# Altium project Dashcam_V2.0B.PrjPcb (part 1 of 9)
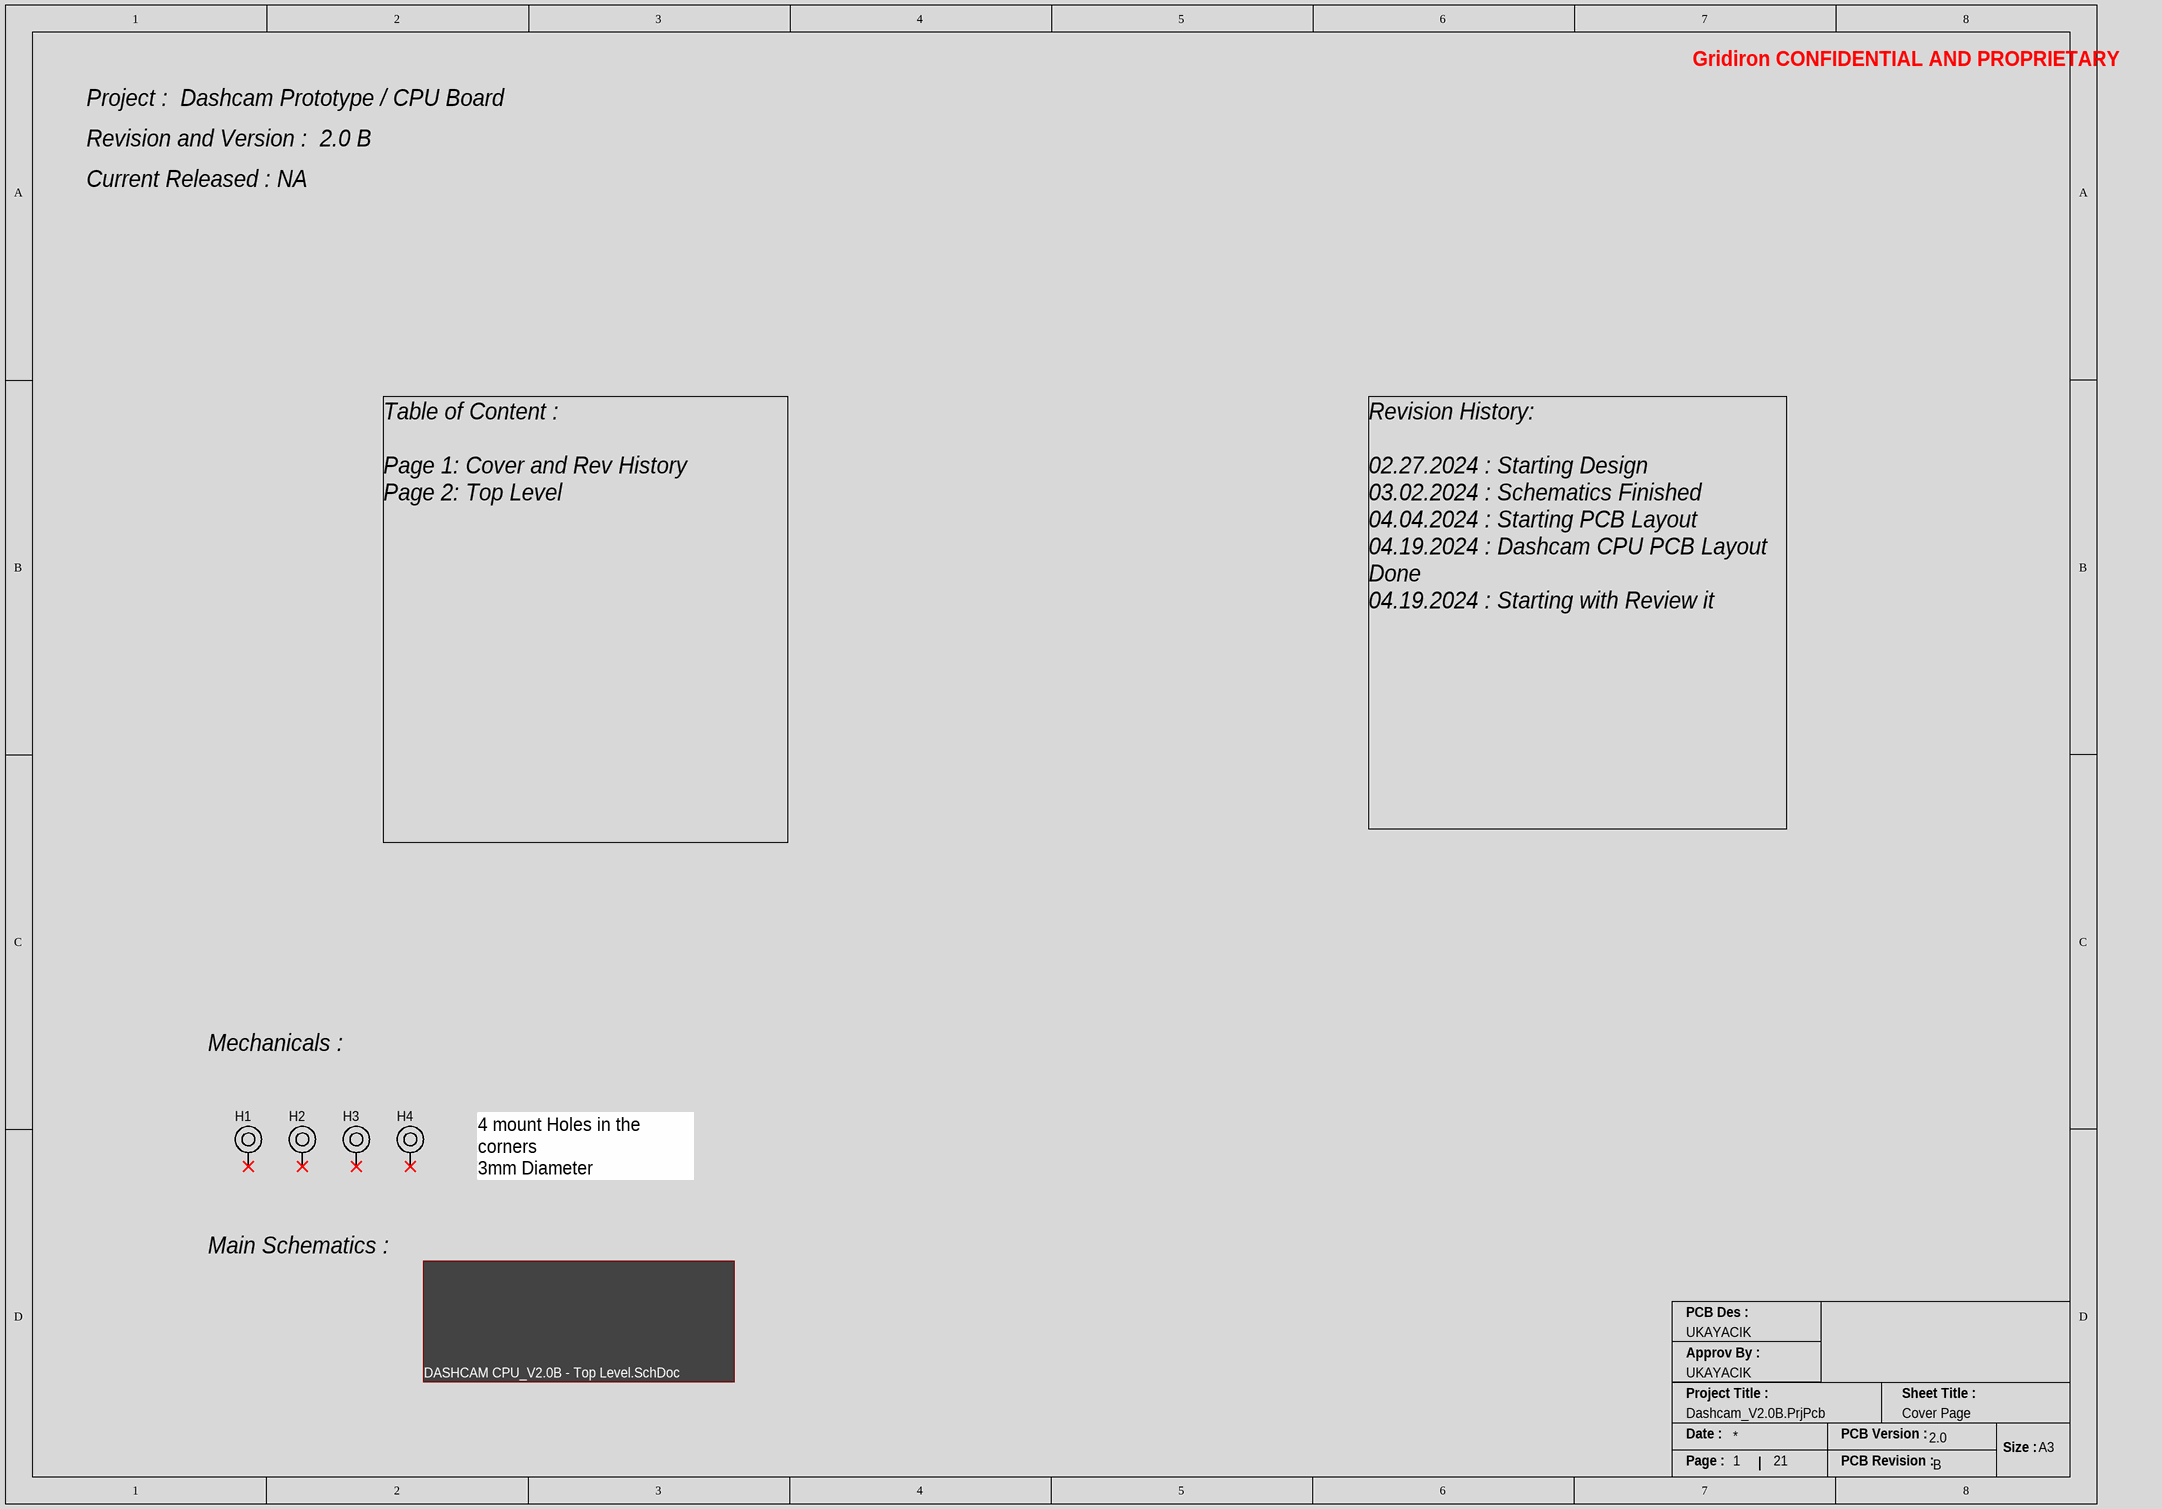
[diagram p0: DASHCAM_V2.0B - Cover and Revisions.SchDoc]
Version: 2.0; ProjectTitle: Dashcam CPU_V2.0B; Letter: B
20 sheets, 411 parts. Net scope: hierarchical (ports join the sheet entries above them; power ports are global).
Board file: Dashcam_V2.0B.PcbDoc
Sheets:
  DASHCAM_V2.0B - Cover and Revisions.SchDoc
  iMX 8M PLUS.SchDoc
    H = CPU IO.SchDoc
    I = CPU LPDDR4.SchDoc
    K = CPU PHY.SchDoc
    J = CPU MISC.SchDoc
    L = CPU Power.SchDoc
  PMIC.SchDoc
    O = Power TREE.SchDoc
    P = Converter.SchDoc
  LPDDR4.SchDoc
  eMMC FLASH.SchDoc
  PERIPHERALS.SchDoc
    Designator = TYPEC_PWR.SchDoc
    Designator = TYPEC_DATA.SchDoc
    U_uSD CARD = uSD CARD.SchDoc
    U_WIFI_BLE = WIFI_BLE.SchDoc
    U_GNSS_GPS_IMU = GNSS_GPS_IMU.SchDoc
    U_DBG BOOT_CONF = DBG BOOT_CONF.SchDoc
    U_CAMERA = CAMERA.SchDoc

## Sheet DASHCAM_V2.0B - Cover and Revisions.SchDoc
size A3; Email: eliofagundez07@gmail.com; DrawnBy: UKAYACIK; Engineer: UKAYACIK; DocumentNumber: 1; Revision: B; SheetNumber: 1; SheetTotal: 21; Sheet Title: Cover Page

### Parts
H1  Mounting Hole  [PTH_3.2X5]  (value not drawn)  (no BOM)
H2  Mounting Hole  [PTH_3.2X5]  (value not drawn)  (no BOM)
H3  Mounting Hole  [PTH_3.2X5]  (value not drawn)  (no BOM)
H4  Mounting Hole  [PTH_3.2X5]  (value not drawn)  (no BOM)

### Sub-sheets
U_DASHCAM CPU_V2.0B - Top Level = DASHCAM CPU_V2.0B - Top Level.SchDoc (file not in this document): no entries

### Nets

Not connected (* = marked no-connect by the designer): H1 1*; H2 1*; H3 1*; H4 1*

### Notes on the sheet
- Project :  Dashcam Prototype / CPU Board
- Gridiron CONFIDENTIAL AND PROPRIETARY
- Revision and Version :  2.0 B
- Current Released : NA
- Table of Content :
  Page 1: Cover and Rev History
  Page 2: Top Level
- Revision History:
  02.27.2024 : Starting Design
  03.02.2024 : Schematics Finished
  04.04.2024 : Starting PCB Layout
  04.19.2024 : Dashcam CPU PCB Layout Done
  04.19.2024 : Starting with Review it
- Mechanicals :
- 4 mount Holes in the corners
  3mm Diameter
- Main Schematics :
- PCB Des :
- Approv By :
- Project Title :
- Sheet Title :
- Date :
- PCB Version :
- Size :
- A3
- Page :
- PCB Revision :

### Library data of the parts
H1-H4 = MECHANICALS_MOUNT_PTH: Mounting Hole, Plated

## Sheet iMX 8M PLUS.SchDoc: i.MX 8M - BLOCK DIAGRAM
size A3; DrawnBy: UKAYACIK; Engineer: UKAYACIK; DocumentNumber: 8; Revision: A; SheetNumber: 3; SheetTotal: 21
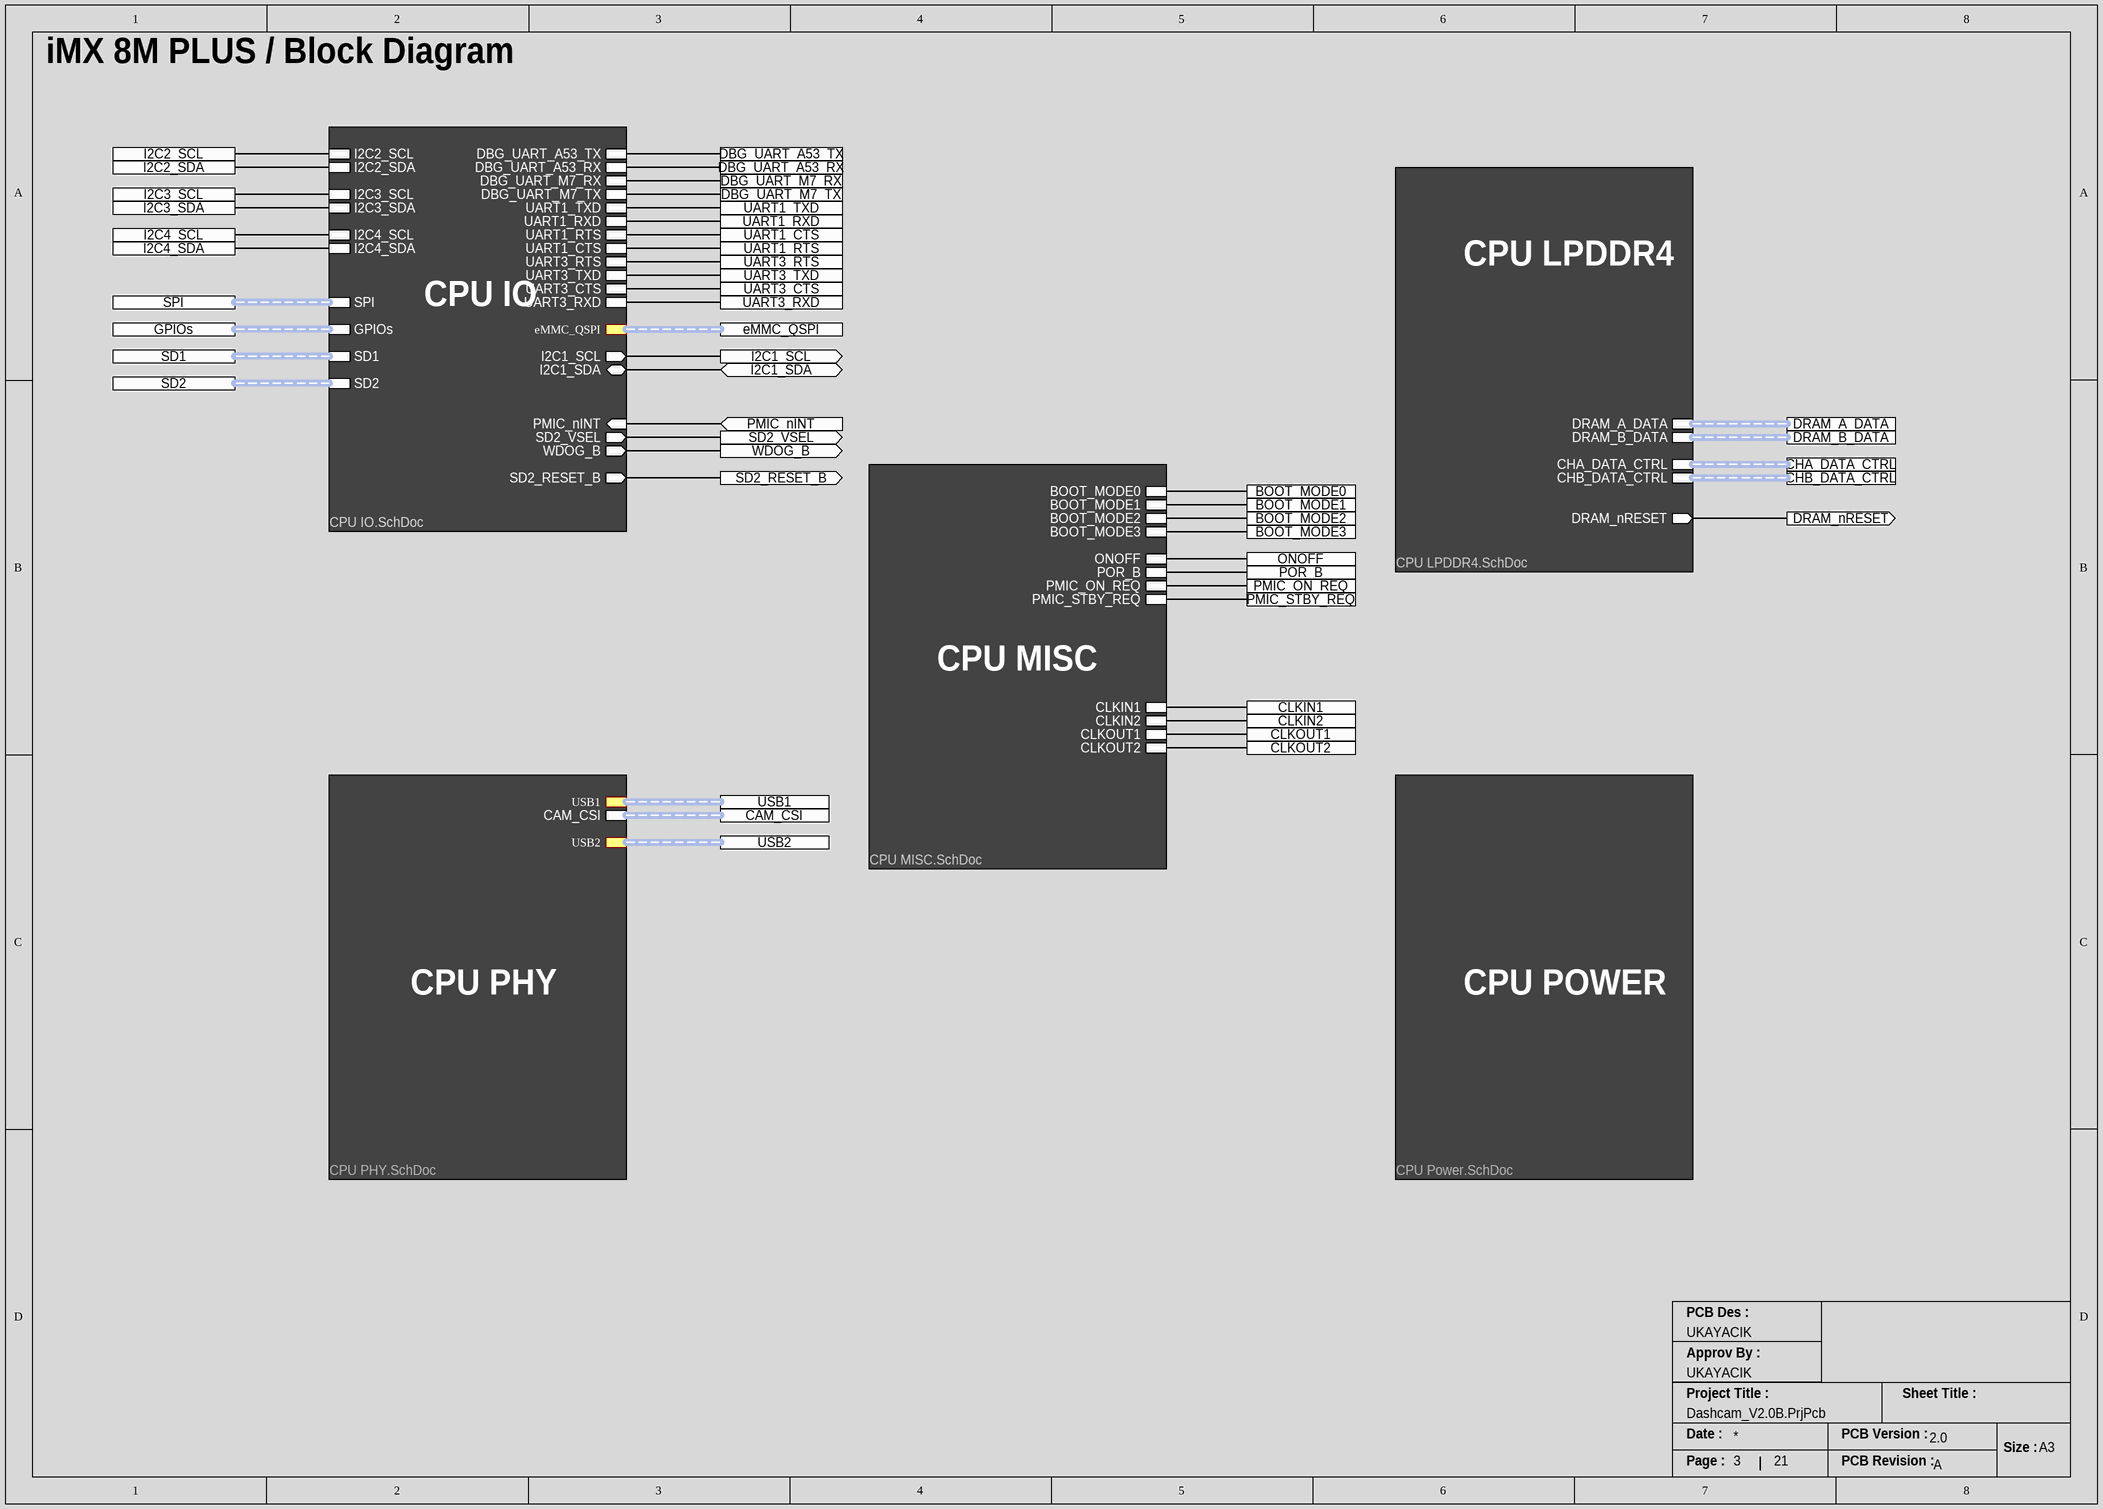
[diagram p1: iMX 8M PLUS.SchDoc]

### Sub-sheets
H = CPU IO.SchDoc: DBG_UART_A53_TX, DBG_UART_A53_RX, DBG_UART_M7_RX, DBG_UART_M7_TX, I2C1_SCL (out), I2C1_SDA (bidir), PMIC_nINT (in), SD2_VSEL (out), WDOG_B (out), SD2_RESET_B (out), UART1_TXD, UART1_RXD, UART1_RTS, UART1_CTS, I2C2_SCL, I2C2_SDA, I2C3_SCL, I2C3_SDA, I2C4_SCL, I2C4_SDA, UART3_RTS, UART3_TXD, UART3_CTS, UART3_RXD, GPIOs (harness GPIOs), SPI (harness SPI), SD1 (harness SD1), SD2 (harness SD2), eMMC_QSPI (harness eMMC_QSPI)
I = CPU LPDDR4.SchDoc: DRAM_nRESET (out), DRAM_A_DATA (harness DRAM_A_DATA), CHA_DATA_CTRL (harness CHA_DATA_CTRL), DRAM_B_DATA (harness DRAM_B_DATA), CHB_DATA_CTRL (harness CHB_DATA_CTRL)
J = CPU MISC.SchDoc: BOOT_MODE0, BOOT_MODE1, ONOFF, POR_B, PMIC_ON_REQ, PMIC_STBY_REQ, CLKIN1, CLKIN2, CLKOUT1, CLKOUT2, BOOT_MODE2, BOOT_MODE3
K = CPU PHY.SchDoc: CAM_CSI (harness CAM_CSI), USB1 (harness USB1), USB2 (harness USB2)
L = CPU Power.SchDoc: no entries

### Ports
BOOT_MODE0, BOOT_MODE1, BOOT_MODE2, BOOT_MODE3, CAM_CSI (harness DRAM_A), CHA_DATA_CTRL (harness DRAM_A), CHB_DATA_CTRL (harness DRAM_A), CLKIN1, CLKIN2, CLKOUT1, CLKOUT2, DBG_UART_A53_RX, DBG_UART_A53_TX, DBG_UART_M7_RX, DBG_UART_M7_TX, DRAM_A_DATA (harness DRAM_A), DRAM_B_DATA (harness DRAM_A), DRAM_nRESET (out), eMMC_QSPI (harness DRAM_A), GPIOs (harness DRAM_A), I2C1_SCL (out), I2C1_SDA (bidir), I2C2_SCL, I2C2_SDA, I2C3_SCL, I2C3_SDA, I2C4_SCL, I2C4_SDA, ONOFF, PMIC_nINT (in), PMIC_ON_REQ, PMIC_STBY_REQ, POR_B, SD1 (harness DRAM_A), SD2 (harness DRAM_A), SD2_RESET_B (out), SD2_VSEL (out), SPI (harness DRAM_A), UART1_CTS, UART1_RTS, UART1_RXD, UART1_TXD, UART3_CTS, UART3_RTS, UART3_RXD, UART3_TXD, USB1 (harness DRAM_A), USB2 (harness DRAM_A), WDOG_B (out)

### Nets
BOOT_MODE0: port BOOT_MODE0, sheet J/BOOT_MODE0
BOOT_MODE1: port BOOT_MODE1, sheet J/BOOT_MODE1
BOOT_MODE2: port BOOT_MODE2, sheet J/BOOT_MODE2
BOOT_MODE3: port BOOT_MODE3, sheet J/BOOT_MODE3
CLKIN1: port CLKIN1, sheet J/CLKIN1
CLKIN2: port CLKIN2, sheet J/CLKIN2
CLKOUT1: port CLKOUT1, sheet J/CLKOUT1
CLKOUT2: port CLKOUT2, sheet J/CLKOUT2
DBG_UART_A53_RX: port DBG_UART_A53_RX, sheet H/DBG_UART_A53_RX
DBG_UART_A53_TX: port DBG_UART_A53_TX, sheet H/DBG_UART_A53_TX
DBG_UART_M7_RX: port DBG_UART_M7_RX, sheet H/DBG_UART_M7_RX
DBG_UART_M7_TX: port DBG_UART_M7_TX, sheet H/DBG_UART_M7_TX
DRAM_nRESET: port DRAM_nRESET, sheet I/DRAM_nRESET
I2C1_SCL: port I2C1_SCL, sheet H/I2C1_SCL
I2C1_SDA: port I2C1_SDA, sheet H/I2C1_SDA
I2C2_SCL: port I2C2_SCL, sheet H/I2C2_SCL
I2C2_SDA: port I2C2_SDA, sheet H/I2C2_SDA
I2C3_SCL: port I2C3_SCL, sheet H/I2C3_SCL
I2C3_SDA: port I2C3_SDA, sheet H/I2C3_SDA
I2C4_SCL: port I2C4_SCL, sheet H/I2C4_SCL
I2C4_SDA: port I2C4_SDA, sheet H/I2C4_SDA
ONOFF: port ONOFF, sheet J/ONOFF
PMIC_nINT: port PMIC_nINT, sheet H/PMIC_nINT
PMIC_ON_REQ: port PMIC_ON_REQ, sheet J/PMIC_ON_REQ
PMIC_STBY_REQ: port PMIC_STBY_REQ, sheet J/PMIC_STBY_REQ
POR_B: port POR_B, sheet J/POR_B
SD2_RESET_B: port SD2_RESET_B, sheet H/SD2_RESET_B
SD2_VSEL: port SD2_VSEL, sheet H/SD2_VSEL
UART1_CTS: port UART1_RTS, sheet H/UART1_CTS
UART1_RTS: port UART1_CTS, sheet H/UART1_RTS
UART1_RXD: port UART1_RXD, sheet H/UART1_RXD
UART1_TXD: port UART1_TXD, sheet H/UART1_TXD
UART3_CTS: port UART3_CTS, sheet H/UART3_CTS
UART3_RTS: port UART3_RTS, sheet H/UART3_RTS
UART3_RXD: port UART3_RXD, sheet H/UART3_RXD
UART3_TXD: port UART3_TXD, sheet H/UART3_TXD
WDOG_B: port WDOG_B, sheet H/WDOG_B

### Buses and harness runs
harness port CAM_CSI = sheet K/CAM_CSI
harness port CHA_DATA_CTRL = sheet I/CHA_DATA_CTRL
harness port CHB_DATA_CTRL = sheet I/CHB_DATA_CTRL
harness port DRAM_A_DATA = sheet I/DRAM_A_DATA
harness port DRAM_B_DATA = sheet I/DRAM_B_DATA
harness port eMMC_QSPI = sheet H/eMMC_QSPI
harness port GPIOs = sheet H/GPIOs
harness port SD1 = sheet H/SD1
harness port SD2 = sheet H/SD2
harness port SPI = sheet H/SPI
harness port USB1 = sheet K/USB1
harness port USB2 = sheet K/USB2

### Notes on the sheet
- iMX 8M PLUS / Block Diagram
- CPU IO
- CPU LPDDR4
- CPU MISC
- CPU PHY
- CPU POWER
- PCB Des :
- Approv By :
- Project Title :
- Sheet Title :
- Date :
- PCB Version :
- Size :
- A3
- Page :
- PCB Revision :

## Sheet CPU IO.SchDoc: CPU IO
size A2; DrawnBy: UKAYACIK; Engineer: UKAYACIK; DocumentNumber: 7; Revision: B; SheetNumber: 8; SheetTotal: 21
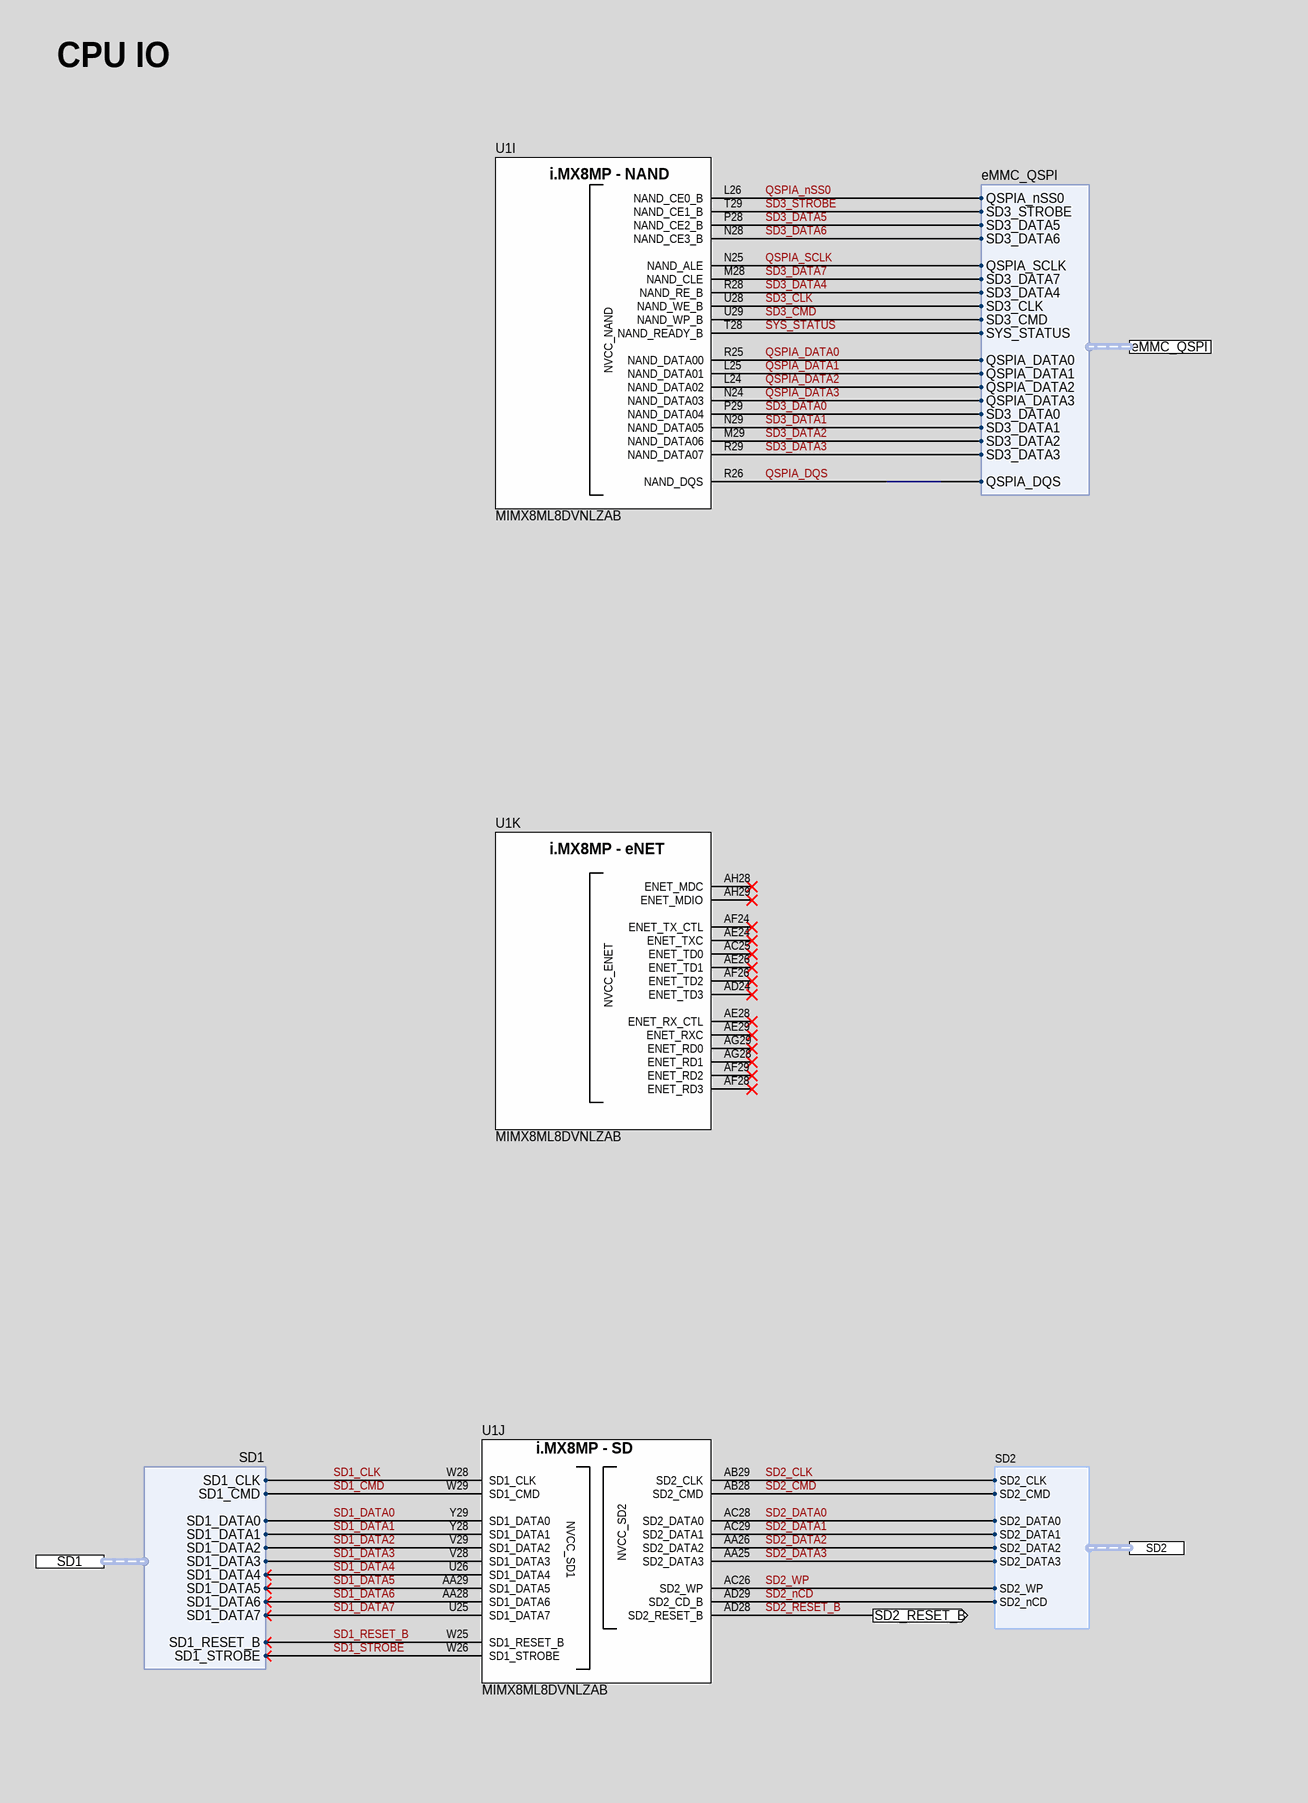
[diagram p2: CPU IO.SchDoc, left]
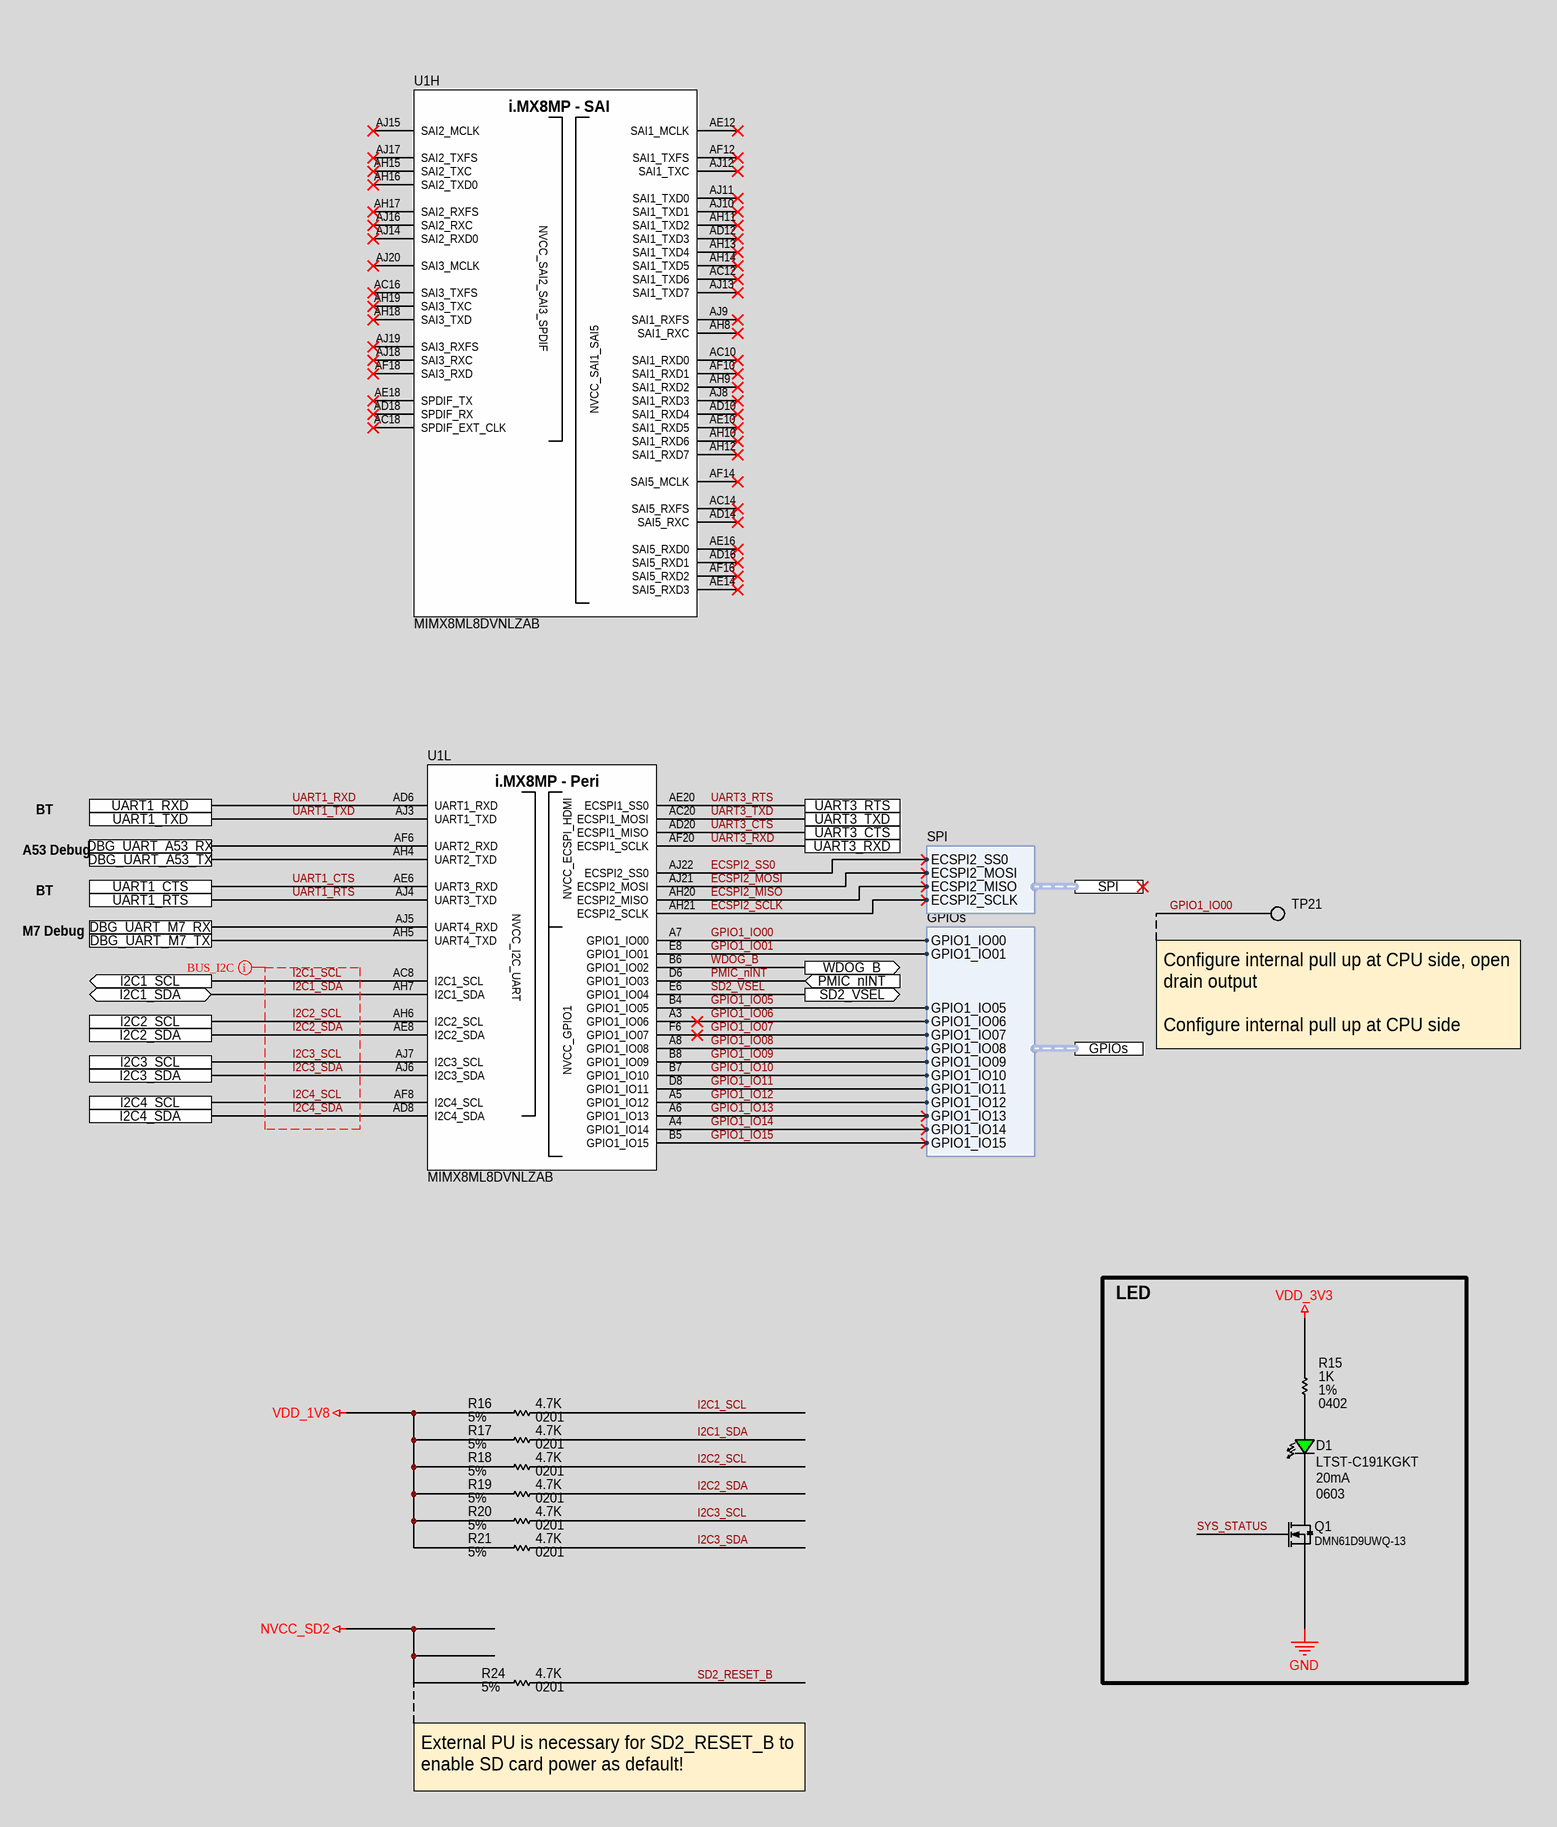
[diagram p3: CPU IO.SchDoc, right]

### Parts
D1  LTST-C191KGKT  Test Current: 20mA  Case/Package: 0603  [LED_0603-GREEN]
Q1  DMN61D9UWQ-13  [SOT-323]
R15  Resistance: 1K  Tolerance: 1%  Case/Package: 0402  [RES_0402_RESC1005X04N]  (hidden comment: ERJ-2RKF1001X)
R16  Tolerance: 5%  Resistance: 4.7K  Case/Package: 0201  [RES_0201_RESC0603X02N]  (hidden comment: RK73B1HTTC472J)
R17  Tolerance: 5%  Resistance: 4.7K  Case/Package: 0201  [RES_0201_RESC0603X02N]  (hidden comment: RK73B1HTTC472J)
R18  Tolerance: 5%  Resistance: 4.7K  Case/Package: 0201  [RES_0201_RESC0603X02N]  (hidden comment: RK73B1HTTC472J)
R19  Tolerance: 5%  Resistance: 4.7K  Case/Package: 0201  [RES_0201_RESC0603X02N]  (hidden comment: RK73B1HTTC472J)
R20  Tolerance: 5%  Resistance: 4.7K  Case/Package: 0201  [RES_0201_RESC0603X02N]  (hidden comment: RK73B1HTTC472J)
R21  Tolerance: 5%  Resistance: 4.7K  Case/Package: 0201  [RES_0201_RESC0603X02N]  (hidden comment: RK73B1HTTC472J)
R24  Tolerance: 5%  Resistance: 4.7K  Case/Package: 0201  [RES_0201_RESC0603X02N]  (hidden comment: RK73B1HTTC472J)
TP21  NO COMPONENT  [TP_PAD_0.5MM_SMD_ROUND]  (value not drawn)  (no BOM)
U1  MIMX8ML8DVNLZAB  [IC_MPU_BGA548C50P29X29_1500X1500X148]  (parts H,I,J,K,L of 15)

### Blocks framed on the sheet
LED: D1 Q1 R15

### Ports
DBG_UART_A53_RX, DBG_UART_A53_TX, DBG_UART_M7_RX, DBG_UART_M7_TX, eMMC_QSPI (harness eMMC_QSPI), GPIOs (harness GPIOs), I2C1_SCL (out), I2C1_SDA (bidir), I2C2_SCL, I2C2_SDA, I2C3_SCL, I2C3_SDA, I2C4_SCL, I2C4_SDA, PMIC_nINT (in), SD1 (harness SD1), SD2 (harness SD2), SD2_RESET_B (out), SD2_VSEL (out), SPI (harness SPI), UART1_CTS, UART1_RTS, UART1_RXD, UART1_TXD, UART3_CTS, UART3_RTS, UART3_RXD, UART3_TXD, WDOG_B (out)

### Harnesses
eMMC_QSPI: SD3_STROBE, SD3_DATA5, SD3_DATA6, SD3_DATA7, SD3_DATA4, SD3_CLK, SD3_CMD, SYS_STATUS, QSPIA_DATA0, QSPIA_DATA1, QSPIA_DATA2, QSPIA_DATA3, QSPIA_nSS0, SD3_DATA0, QSPIA_SCLK, SD3_DATA1, SD3_DATA2, SD3_DATA3, QSPIA_DQS
SD1: SD1_CMD, SD1_DATA0, SD1_DATA1, SD1_DATA2, SD1_DATA3, SD1_DATA4, SD1_DATA6, SD1_DATA7, SD1_RESET_B, SD1_STROBE, SD1_CLK, SD1_DATA5
GPIOs: GPIO1_IO00, GPIO1_IO01, GPIO1_IO05, GPIO1_IO06, GPIO1_IO07, GPIO1_IO08, GPIO1_IO09, GPIO1_IO10, GPIO1_IO11, GPIO1_IO12, GPIO1_IO13, GPIO1_IO14, GPIO1_IO15
SPI: ECSPI2_SS0, ECSPI2_MOSI, ECSPI2_MISO, ECSPI2_SCLK
SD2: SD2_CLK, SD2_CMD, SD2_DATA0, SD2_DATA1, SD2_DATA2, SD2_DATA3, SD2_WP, SD2_nCD

### Nets
GND: Q1.S
NVCC_SD2: R24.1
VDD_1V8: R16.1 R17.1 R18.1 R19.1 R20.1 R21.1
VDD_3V3: R15.2
DBG_UART_A53_RX: U1.AF6(UART2_RXD) ; port DBG_UART_A53_RX
DBG_UART_A53_TX: U1.AH4(UART2_TXD) ; port DBG_UART_A53_TX
DBG_UART_M7_RX: U1.AJ5(UART4_RXD) ; port DBG_UART_M7_RX
DBG_UART_M7_TX: U1.AH5(UART4_TXD) ; port DBG_UART_M7_TX
ECSPI2_MISO: U1.AH20(ECSPI2_MISO) ; port SPI.ECSPI2_MISO
ECSPI2_MOSI: U1.AJ21(ECSPI2_MOSI) ; port SPI.ECSPI2_MOSI
ECSPI2_SCLK: U1.AH21(ECSPI2_SCLK) ; port SPI.ECSPI2_SCLK
ECSPI2_SS0: U1.AJ22(ECSPI2_SS0) ; port SPI.ECSPI2_SS0
GPIO1_IO00: TP21.1 U1.A7(GPIO1_IO00) ; port GPIOs.GPIO1_IO00
GPIO1_IO01: U1.E8(GPIO1_IO01) ; port GPIOs.GPIO1_IO01
GPIO1_IO05: U1.B4(GPIO1_IO05) ; port GPIOs.GPIO1_IO05
GPIO1_IO06: U1.A3(GPIO1_IO06) ; port GPIOs.GPIO1_IO06
GPIO1_IO07: U1.F6(GPIO1_IO07) ; port GPIOs.GPIO1_IO07
GPIO1_IO08: U1.A8(GPIO1_IO08) ; port GPIOs.GPIO1_IO08
GPIO1_IO09: U1.B8(GPIO1_IO09) ; port GPIOs.GPIO1_IO09
GPIO1_IO10: U1.B7(GPIO1_IO10) ; port GPIOs.GPIO1_IO10
GPIO1_IO11: U1.D8(GPIO1_IO11) ; port GPIOs.GPIO1_IO11
GPIO1_IO12: U1.A5(GPIO1_IO12) ; port GPIOs.GPIO1_IO12
GPIO1_IO13: U1.A6(GPIO1_IO13) ; port GPIOs.GPIO1_IO13
GPIO1_IO14: U1.A4(GPIO1_IO14) ; port GPIOs.GPIO1_IO14
GPIO1_IO15: U1.B5(GPIO1_IO15) ; port GPIOs.GPIO1_IO15
I2C1_SCL: R16.2 U1.AC8(I2C1_SCL) ; port I2C1_SCL
I2C1_SDA: R17.2 U1.AH7(I2C1_SDA) ; port I2C1_SDA
I2C2_SCL: R18.2 U1.AH6(I2C2_SCL) ; port I2C2_SCL
I2C2_SDA: R19.2 U1.AE8(I2C2_SDA) ; port I2C2_SDA
I2C3_SCL: R20.2 U1.AJ7(I2C3_SCL) ; port I2C3_SCL
I2C3_SDA: R21.2 U1.AJ6(I2C3_SDA) ; port I2C3_SDA
I2C4_SCL: U1.AF8(I2C4_SCL) ; port I2C4_SCL
I2C4_SDA: U1.AD8(I2C4_SDA) ; port I2C4_SDA
PMIC_nINT: U1.D6(GPIO1_IO03) ; port PMIC_nINT
QSPIA_DATA0: U1.R25(NAND_DATA00) ; port eMMC_QSPI.QSPIA_DATA0
QSPIA_DATA1: U1.L25(NAND_DATA01) ; port eMMC_QSPI.QSPIA_DATA1
QSPIA_DATA2: U1.L24(NAND_DATA02) ; port eMMC_QSPI.QSPIA_DATA2
QSPIA_DATA3: U1.N24(NAND_DATA03) ; port eMMC_QSPI.QSPIA_DATA3
QSPIA_DQS: U1.R26(NAND_DQS) ; port eMMC_QSPI.QSPIA_DQS
QSPIA_nSS0: U1.L26(NAND_CE0_B) ; port eMMC_QSPI.QSPIA_nSS0
QSPIA_SCLK: U1.N25(NAND_ALE) ; port eMMC_QSPI.QSPIA_SCLK
SD1_CLK: U1.W28(SD1_CLK) ; port SD1.SD1_CLK
SD1_CMD: U1.W29(SD1_CMD) ; port SD1.SD1_CMD
SD1_DATA0: U1.Y29(SD1_DATA0) ; port SD1.SD1_DATA0
SD1_DATA1: U1.Y28(SD1_DATA1) ; port SD1.SD1_DATA1
SD1_DATA2: U1.V29(SD1_DATA2) ; port SD1.SD1_DATA2
SD1_DATA3: U1.V28(SD1_DATA3) ; port SD1.SD1_DATA3
SD1_DATA4: U1.U26(SD1_DATA4) ; port SD1.SD1_DATA4
SD1_DATA5: U1.AA29(SD1_DATA5) ; port SD1.SD1_DATA5
SD1_DATA6: U1.AA28(SD1_DATA6) ; port SD1.SD1_DATA6
SD1_DATA7: U1.U25(SD1_DATA7) ; port SD1.SD1_DATA7
SD1_RESET_B: U1.W25(SD1_RESET_B) ; port SD1.SD1_RESET_B
SD1_STROBE: U1.W26(SD1_STROBE) ; port SD1.SD1_STROBE
SD2_CLK: U1.AB29(SD2_CLK) ; port SD2.SD2_CLK
SD2_CMD: U1.AB28(SD2_CMD) ; port SD2.SD2_CMD
SD2_DATA0: U1.AC28(SD2_DATA0) ; port SD2.SD2_DATA0
SD2_DATA1: U1.AC29(SD2_DATA1) ; port SD2.SD2_DATA1
SD2_DATA2: U1.AA26(SD2_DATA2) ; port SD2.SD2_DATA2
SD2_DATA3: U1.AA25(SD2_DATA3) ; port SD2.SD2_DATA3
SD2_nCD: U1.AD29(SD2_CD_B) ; port SD2.SD2_nCD
SD2_RESET_B: R24.2 U1.AD28(SD2_RESET_B) ; port SD2_RESET_B
SD2_VSEL: U1.E6(GPIO1_IO04) ; port SD2_VSEL
SD2_WP: U1.AC26(SD2_WP) ; port SD2.SD2_WP
SD3_CLK: U1.U28(NAND_WE_B) ; port eMMC_QSPI.SD3_CLK
SD3_CMD: U1.U29(NAND_WP_B) ; port eMMC_QSPI.SD3_CMD
SD3_DATA0: U1.P29(NAND_DATA04) ; port eMMC_QSPI.SD3_DATA0
SD3_DATA1: U1.N29(NAND_DATA05) ; port eMMC_QSPI.SD3_DATA1
SD3_DATA2: U1.M29(NAND_DATA06) ; port eMMC_QSPI.SD3_DATA2
SD3_DATA3: U1.R29(NAND_DATA07) ; port eMMC_QSPI.SD3_DATA3
SD3_DATA4: U1.R28(NAND_RE_B) ; port eMMC_QSPI.SD3_DATA4
SD3_DATA5: U1.P28(NAND_CE2_B) ; port eMMC_QSPI.SD3_DATA5
SD3_DATA6: U1.N28(NAND_CE3_B) ; port eMMC_QSPI.SD3_DATA6
SD3_DATA7: U1.M28(NAND_CLE) ; port eMMC_QSPI.SD3_DATA7
SD3_STROBE: U1.T29(NAND_CE1_B) ; port eMMC_QSPI.SD3_STROBE
SYS_STATUS: Q1.G U1.T28(NAND_READY_B) ; port eMMC_QSPI.SYS_STATUS
UART1_CTS: U1.AE6(UART3_RXD) ; port UART1_CTS
UART1_RTS: U1.AJ4(UART3_TXD) ; port UART1_RTS
UART1_RXD: U1.AD6(UART1_RXD) ; port UART1_RXD
UART1_TXD: U1.AJ3(UART1_TXD) ; port UART1_TXD
UART3_CTS: U1.AD20(ECSPI1_MISO) ; port UART3_CTS
UART3_RTS: U1.AE20(ECSPI1_SS0) ; port UART3_RTS
UART3_RXD: U1.AF20(ECSPI1_SCLK) ; port UART3_RXD
UART3_TXD: U1.AC20(ECSPI1_MOSI) ; port UART3_TXD
WDOG_B: U1.B6(GPIO1_IO02) ; port WDOG_B
NetD1_1: D1.1(C) Q1.D
NetD1_2: D1.2(A) R15.1

Not connected (* = marked no-connect by the designer): U1 AC10(SAI1_RXD0)* AC12(SAI1_TXD6)* AC14(SAI5_RXFS)* AC16(SAI3_TXFS)* AC18(SPDIF_EXT_CLK)* AC25(ENET_TD0)* AD10(SAI1_RXD4)* AD12(SAI1_TXD3)* AD14(SAI5_RXC)* AD16(SAI5_RXD1)* AD18(SPDIF_RX)* AD24(ENET_TD3)* AE10(SAI1_RXD5)* AE12(SAI1_MCLK)* AE14(SAI5_RXD3)* AE16(SAI5_RXD0)* AE18(SPDIF_TX)* AE24(ENET_TXC)* AE26(ENET_TD1)* AE28(ENET_RX_CTL)* AE29(ENET_RXC)* AF10(SAI1_RXD1)* AF12(SAI1_TXFS)* AF14(SAI5_MCLK)* AF16(SAI5_RXD2)* AF18(SAI3_RXD)* AF24(ENET_TX_CTL)* AF26(ENET_TD2)* AF28(ENET_RD3)* AF29(ENET_RD2)* AG28(ENET_RD1)* AG29(ENET_RD0)* AH8(SAI1_RXC)* AH9(SAI1_RXD2)* AH10(SAI1_RXD6)* AH11(SAI1_TXD2)* AH12(SAI1_RXD7)* AH13(SAI1_TXD4)* AH14(SAI1_TXD5)* AH15(SAI2_TXC)* AH16(SAI2_TXD0)* AH17(SAI2_RXFS)* AH18(SAI3_TXD)* AH19(SAI3_TXC)* AH28(ENET_MDC)* AH29(ENET_MDIO)* AJ8(SAI1_RXD3)* AJ9(SAI1_RXFS)* AJ10(SAI1_TXD1)* AJ11(SAI1_TXD0)* AJ12(SAI1_TXC)* AJ13(SAI1_TXD7)* AJ14(SAI2_RXD0)* AJ15(SAI2_MCLK)* AJ16(SAI2_RXC)* AJ17(SAI2_TXFS)* AJ18(SAI3_RXC)* AJ19(SAI3_RXFS)* AJ20(SAI3_MCLK)*

### Layout directives
net class I2C: I2C1_SCL, I2C1_SDA, I2C2_SCL, I2C2_SDA, I2C3_SCL, I2C3_SDA, I2C4_SCL, I2C4_SDA

### Notes on the sheet
- CPU IO
- BT
- A53 Debug
- M7 Debug
- (near TP21) Configure internal pull up at CPU side, open drain output
  Configure internal pull up at CPU side
- (near Q1) Blink:  SYS_STATUS
- (near R24) External PU is necessary for SD2_RESET_B to enable SD card power as default!
- PCB Des :
- Approv By :
- Project Title :
- Sheet Title :
- Date :
- Page :
- PCB Version :
- PCB Revision :
- Size :
- A2
- (in symbol IC_MPU_8M_PLUS_MIMX8ML8DVNLZAB, part H) i.MX8MP - SAI
- (in symbol IC_MPU_8M_PLUS_MIMX8ML8DVNLZAB, part I) i.MX8MP - NAND
- (in symbol IC_MPU_8M_PLUS_MIMX8ML8DVNLZAB, part J) i.MX8MP - SD
- (in symbol IC_MPU_8M_PLUS_MIMX8ML8DVNLZAB, part K) i.MX8MP - eNET
- (in symbol IC_MPU_8M_PLUS_MIMX8ML8DVNLZAB, part L) i.MX8MP - Peri; NVCC_GPIO1

### Library data of the parts
D1 = LED_DIO_GREEN_20mA_0603: LTST-C191KGKT Lite-On LED, green, 18-71mcd, 130, 1.9V-2.4V SMD, 0603 1.6x0.8x0.55mm RoHS; Manufacturer: Vishay Lite-On; Lens Color: Colorless; Luminous Intensity: 35mcd; Viewing Angle: 130°; Forward Voltage: 2V; Dominant Wavelength: 571nm; Lens Transparency: Clear; Wavelength: 574nm; Lens Style: Flat,Rectangular,Colorless; Number of LEDs: 1; Max Power Dissipation: 75mW; Lens Size: 0.8mm; Supplier 1: Digi-Key; Manufacturer Part Number: LTST-C191KGKT; RoHS: Yes; Stock 1: 1556161; Pricing 1: 1=0.26, 10=0.143, 100=0.0663, 500=0.0612, 1000=0.04794, 2000=0.04693 (USD); Mount: Surface Mount; Number of Pins: 2; Color: Green; Case Code (Metric): 1608; Case Code (Imperial): 0603; Min Operating Temperature: -55°C; Max Operating Temperature: 85°C; Packaging: Tape and Reel; Series: -; Length: 1.6mm; Width: 0.8mm; Height: 0.65mm; RoHS Compliant: Yes; Lead Free: Lead Free; ComponentLink1URL: https://datasheet.ciiva.com/2109/ltst-c191kgkt-2109973.pdf?src-supplier=Digi-Key; ComponentLink1Description: https://datasheet.ciiva.com/2109/ltst-c191kgkt-2109973.pdf?src-supplier=Digi-Key; Supplier Part Number 1: 160-1446-1-ND
Q1 = TRANS_FET_CHA_N_60V_340mA: N-Channel Enhancement Mode MOSFET 60V 340mA 3-Pin SOT-323 T/R; Manufacturer: Diodes; Continuous Drain Current (ID): 400mA; Rds On Max: 2R; Input Capacitance: 28.5pF; Max Power Dissipation: 440mW; Supplier 1: Digi-Key; Manufacturer Part Number: DMN61D9UWQ-13; RoHS: Yes; Category: MOSFETs; Stock 1: 209235; Pricing 1: 1=0.35, 10=0.259, 100=0.1468, 500=0.0972, 1000=0.07452, 2000=0.0648, 5000=0.05832 (USD); Mount: Surface Mount; Case/Package: SOT-323; Min Operating Temperature: -55°C; Max Operating Temperature: 150°C; Packaging: Cut Tape; Drain to Source Voltage (Vdss): 60V; Series: -; RoHS Compliant: Yes; ComponentLink1URL: https://www.diodes.com/assets/Datasheets/DMN61D9UWQ.pdf?src-supplier=Digi-Key; ComponentLink1Description: https://www.diodes.com/assets/Datasheets/DMN61D9UWQ.pdf?src-supplier=Digi-Key; ComponentLink2URL: https://datasheet.octopart.com/DMN61D9UWQ-13-Diodes-Inc.-datasheet-151210411.pdf?src-supplier=Farnell; ComponentLink2Description: https://datasheet.octopart.com/DMN61D9UWQ-13-Diodes-Inc.-datasheet-151210411.pdf?src-supplier=Farnell; ComponentLink3URL: https://datasheet.octopart.com/DMN61D9UWQ-13-Diodes-Inc.-datasheet-165191130.pdf?src-supplier=Future+Electronics; ComponentLink3Description: https://datasheet.octopart.com/DMN61D9UWQ-13-Diodes-Inc.-datasheet-165191130.pdf?src-supplier=Future+Electronics; Supplier Part Number 1: DMN61D9UWQ-13DICT-ND
R15 = RES_1K_1%_100mW_0402: RES SMD 1K OHM 1% 1/10W 0402; Manufacturer: Panasonic; Temperature Coefficient: 100ppm/°C; Max Power Dissipation: 100mW; Voltage Rating (DC): 50V; Supplier 1: Digi-Key; Manufacturer Part Number: ERJ-2RKF1001X; RoHS: Yes; Category: Chip SMD Resistors; Stock 1: 2367361; Pricing 1: 1=0.1, 10=0.029, 50=0.0162, 100=0.0119, 500=0.00728, 1000=0.00535, 5000=0.00384 (USD); Mount: Surface Mount; Number of Pins: 2; Case Code (Imperial): 0402; Case Code (Metric): 1005; Contact Plating: Tin; Min Operating Temperature: -55°C; Max Operating Temperature: 155°C; Packaging: Tape and Reel; Number of Terminations: 2; Features: Automotive AEC-Q200; Voltage Rating: 50V; Power Rating: 100mW; Package Quantity: 1; Termination: SMD/SMT; Resistor Type: Thick Film; Series: ERJ; Resistance Tolerance: 1%; Construction: Rectangular; Technology: THICK FILM; Length: 1mm; Width: 0.5mm; Height: 0.35mm; Depth: 0.5mm; Lead Free: Lead Free; RoHS Compliant: Yes; Reach SVHC Compliant: Yes; Military Standard: Not; Supplier Part Number 1: P1.00KLCT-ND
R16-R21 R24 = RES_4.7K_5%_50mW_0201: Res Thick Film 0201 4.7K Ohm 5% 0.05W(1/20W) ±200ppm/C Pad SMD Automotive T/R; Manufacturer: KOA Speer; Power Rating: 50mW; Voltage Rating: 25V; Temperature Coefficient: 200ppm/°C; Supplier 1: Digikey; Manufacturer Part Number: RK73B1HTTC472J; RoHS: Yes; Category: Chip SMD Resistors; Stock 1: 410528; Pricing 1: 1=0.1, 10=0.033, 50=0.021, 100=0.0177, 500=0.01224, 1000=0.0106, 5000=0.00782 (USD); Case Code (Imperial): 0201; Case Code (Metric): 0603; Min Operating Temperature: -55°C; Max Operating Temperature: 125°C; Packaging: Tape and Reel; Termination: SMD/SMT; Voltage Rating (DC): 25V; Series: RK73B; Construction: Rectangular; Length: 0.6mm; Depth: 0.3mm; Military Standard: Not; Lead Free: Lead Free; RoHS Compliant: Yes; ComponentLink1URL: https://datasheet.ciiva.com/5556/rk73b-5556381.pdf?src-supplier=Mouser; ComponentLink1Description: https://datasheet.ciiva.com/5556/rk73b-5556381.pdf?src-supplier=Mouser; Supplier Part Number 1: 2019-RK73B1HTTC472JDKR-ND
TP21 = TP_PAD_SMD_SMALL: Test Point, SMD pad, round, 1.5mm, 1.6mm, 3mm diameter
U1 = IC_MPU_8M_PLUS_MIMX8ML8DVNLZAB: i.MX 8M Plus, Consumer, / TRAY TRAY MULTIPLE DP BAKEABLE RoHS Compliant: Yes; Manufacturer: NXP Semiconductors; Supplier 1: Arrow Electronics; Manufacturer Part Number: MIMX8ML8DVNLZAB; RoHS: Yes; Category: Microprocessors; Stock 1: 1036; Pricing 1: 1=54.8, 5=52.24, 10=44.19, 25=42.8, 50=39.95, 100=31.83 (USD); Supplier Part Number 1: MIMX8ML8DVNLZAB

## Sheet CPU LPDDR4.SchDoc: CPU DDR
size A3; DrawnBy: UKAYACIK; Engineer: UKAYACIK; DocumentNumber: 4; Revision: B; SheetNumber: 5; SheetTotal: 21
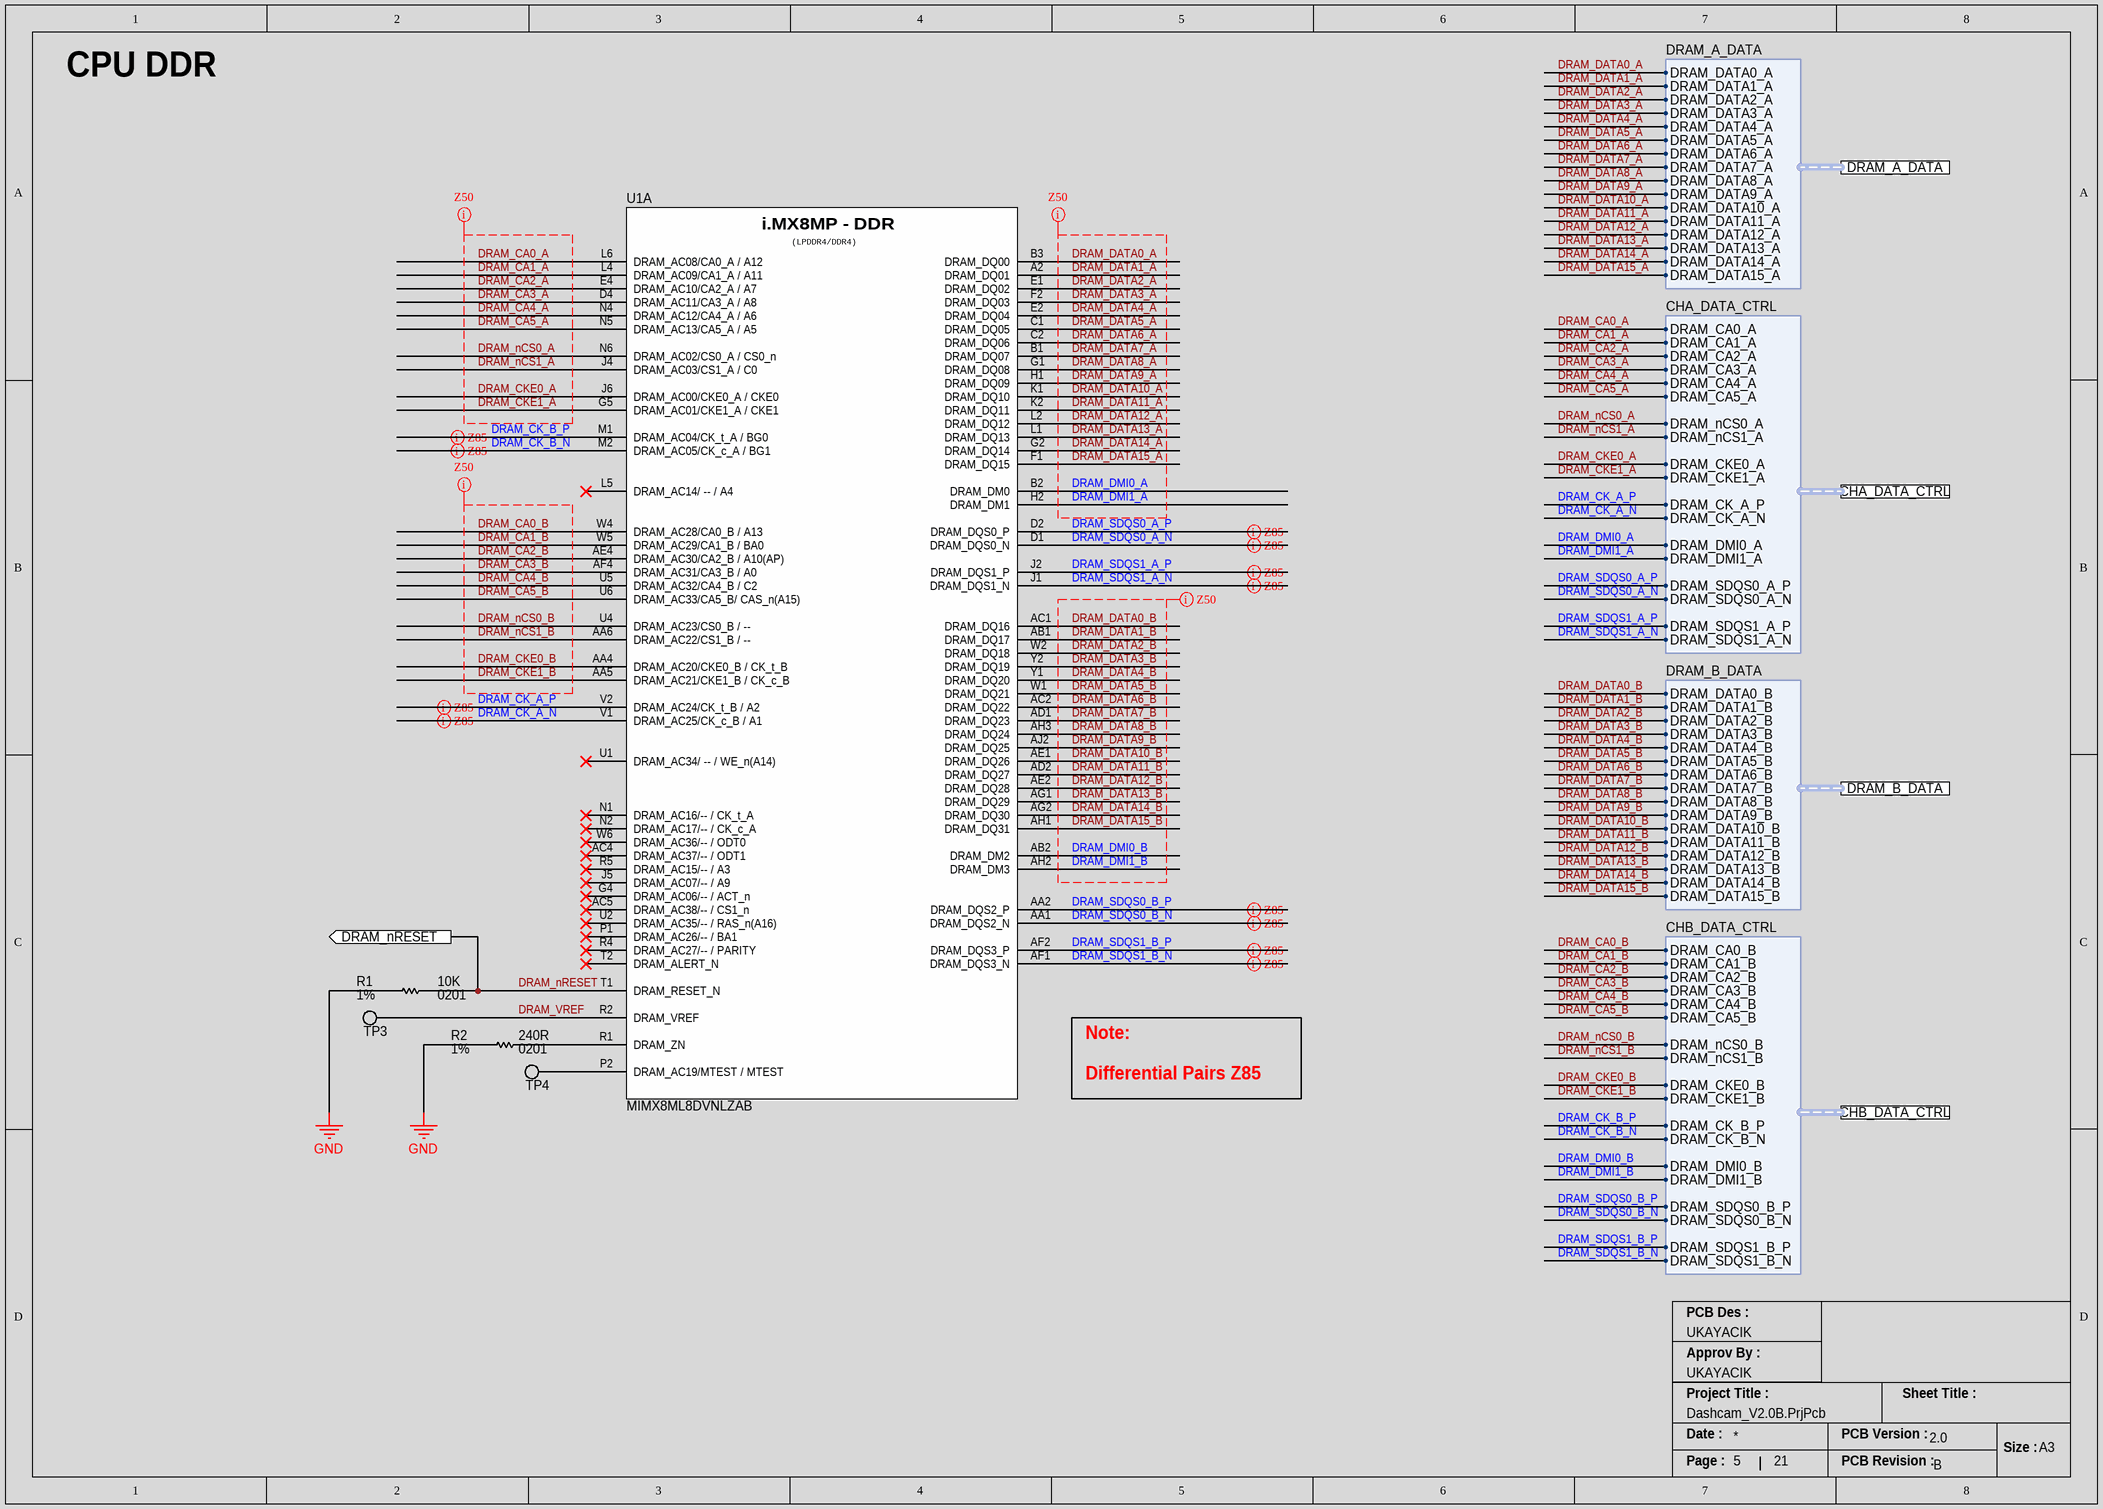
[diagram p4: CPU LPDDR4.SchDoc]

### Parts
R1  Tolerance: 1%  Resistance: 10K  Case Code (Imperial): 0201  [RES_0201_RESC0603X02N]  (hidden comment: RC0201FR-0710KL)
R2  Tolerance: 1%  Resistance: 240R  Case/Package: 0201  [RES_0201_RESC0603X02N]  (hidden comment: RC0201FR-07240RL)
TP3  NO COMPONENT  [TP_PAD_0.5MM_SMD_ROUND]  (value not drawn)  (no BOM)
TP4  NO COMPONENT  [TP_PAD_0.5MM_SMD_ROUND]  (value not drawn)  (no BOM)
U1  MIMX8ML8DVNLZAB  [IC_MPU_BGA548C50P29X29_1500X1500X148]  (part A of 15)

### Ports
CHA_DATA_CTRL (harness CHA_DATA_CTRL), CHB_DATA_CTRL (harness CHB_DATA_CTRL), DRAM_A_DATA (harness DRAM_A_DATA), DRAM_B_DATA (harness DRAM_B_DATA), DRAM_nRESET (out)

### Harnesses
DRAM_A_DATA: DRAM_DATA0_A, DRAM_DATA1_A, DRAM_DATA2_A, DRAM_DATA3_A, DRAM_DATA4_A, DRAM_DATA5_A, DRAM_DATA6_A, DRAM_DATA7_A, DRAM_DATA8_A, DRAM_DATA9_A, DRAM_DATA10_A, DRAM_DATA11_A, DRAM_DATA12_A, DRAM_DATA13_A, DRAM_DATA14_A, DRAM_DATA15_A
CHA_DATA_CTRL: DRAM_CA0_A, DRAM_CA1_A, DRAM_CA2_A, DRAM_CA3_A, DRAM_CA4_A, DRAM_CA5_A, DRAM_nCS0_A, DRAM_nCS1_A, DRAM_CKE0_A, DRAM_CKE1_A, DRAM_CK_A_P, DRAM_CK_A_N, DRAM_DMI0_A, DRAM_DMI1_A, DRAM_SDQS0_A_P, DRAM_SDQS0_A_N, DRAM_SDQS1_A_P, DRAM_SDQS1_A_N
DRAM_B_DATA: DRAM_DATA0_B, DRAM_DATA1_B, DRAM_DATA2_B, DRAM_DATA3_B, DRAM_DATA4_B, DRAM_DATA5_B, DRAM_DATA6_B, DRAM_DATA7_B, DRAM_DATA8_B, DRAM_DATA9_B, DRAM_DATA10_B, DRAM_DATA11_B, DRAM_DATA12_B, DRAM_DATA13_B, DRAM_DATA14_B, DRAM_DATA15_B
CHB_DATA_CTRL: DRAM_CA0_B, DRAM_CA1_B, DRAM_CA2_B, DRAM_CA3_B, DRAM_CA4_B, DRAM_CA5_B, DRAM_nCS0_B, DRAM_nCS1_B, DRAM_CKE0_B, DRAM_CKE1_B, DRAM_CK_B_P, DRAM_CK_B_N, DRAM_DMI0_B, DRAM_DMI1_B, DRAM_SDQS0_B_P, DRAM_SDQS0_B_N, DRAM_SDQS1_B_P, DRAM_SDQS1_B_N

### Nets
GND: R1.1 R2.1
DRAM_CA0_A: U1.L6(DRAM_AC08/CA0_A_/_A12) ; port CHA_DATA_CTRL.DRAM_CA0_A
DRAM_CA0_B: U1.W4(DRAM_AC28/CA0_B_/_A13) ; port CHB_DATA_CTRL.DRAM_CA0_B
DRAM_CA1_A: U1.L4(DRAM_AC09/CA1_A_/_A11) ; port CHA_DATA_CTRL.DRAM_CA1_A
DRAM_CA1_B: U1.W5(DRAM_AC29/CA1_B_/_BA0) ; port CHB_DATA_CTRL.DRAM_CA1_B
DRAM_CA2_A: U1.E4(DRAM_AC10/CA2_A_/_A7) ; port CHA_DATA_CTRL.DRAM_CA2_A
DRAM_CA2_B: U1.AE4(DRAM_AC30/CA2_B_/_A10(AP)) ; port CHB_DATA_CTRL.DRAM_CA2_B
DRAM_CA3_A: U1.D4(DRAM_AC11/CA3_A_/_A8) ; port CHA_DATA_CTRL.DRAM_CA3_A
DRAM_CA3_B: U1.AF4(DRAM_AC31/CA3_B_/_A0) ; port CHB_DATA_CTRL.DRAM_CA3_B
DRAM_CA4_A: U1.N4(DRAM_AC12/CA4_A_/_A6) ; port CHA_DATA_CTRL.DRAM_CA4_A
DRAM_CA4_B: U1.U5(DRAM_AC32/CA4_B_/_C2) ; port CHB_DATA_CTRL.DRAM_CA4_B
DRAM_CA5_A: U1.N5(DRAM_AC13/CA5_A_/_A5) ; port CHA_DATA_CTRL.DRAM_CA5_A
DRAM_CA5_B: U1.U6(DRAM_AC33/CA5_B/_CAS_n(A15)) ; port CHB_DATA_CTRL.DRAM_CA5_B
DRAM_CK_A_N: U1.V1(DRAM_AC25/CK_c_B_/_A1) ; port CHA_DATA_CTRL.DRAM_CK_A_N
DRAM_CK_A_P: U1.V2(DRAM_AC24/CK_t_B_/_A2) ; port CHA_DATA_CTRL.DRAM_CK_A_P
DRAM_CK_B_N: U1.M2(DRAM_AC05/CK_c_A_/_BG1) ; port CHB_DATA_CTRL.DRAM_CK_B_N
DRAM_CK_B_P: U1.M1(DRAM_AC04/CK_t_A_/_BG0) ; port CHB_DATA_CTRL.DRAM_CK_B_P
DRAM_CKE0_A: U1.J6(DRAM_AC00/CKE0_A_/_CKE0) ; port CHA_DATA_CTRL.DRAM_CKE0_A
DRAM_CKE0_B: U1.AA4(DRAM_AC20/CKE0_B_/_CK_t_B) ; port CHB_DATA_CTRL.DRAM_CKE0_B
DRAM_CKE1_A: U1.G5(DRAM_AC01/CKE1_A_/_CKE1) ; port CHA_DATA_CTRL.DRAM_CKE1_A
DRAM_CKE1_B: U1.AA5(DRAM_AC21/CKE1_B_/_CK_c_B) ; port CHB_DATA_CTRL.DRAM_CKE1_B
DRAM_DATA0_A: U1.B3(DRAM_DQ00) ; port DRAM_A_DATA.DRAM_DATA0_A
DRAM_DATA0_B: U1.AC1(DRAM_DQ16) ; port DRAM_B_DATA.DRAM_DATA0_B
DRAM_DATA1_A: U1.A2(DRAM_DQ01) ; port DRAM_A_DATA.DRAM_DATA1_A
DRAM_DATA1_B: U1.AB1(DRAM_DQ17) ; port DRAM_B_DATA.DRAM_DATA1_B
DRAM_DATA2_A: U1.E1(DRAM_DQ02) ; port DRAM_A_DATA.DRAM_DATA2_A
DRAM_DATA2_B: U1.W2(DRAM_DQ18) ; port DRAM_B_DATA.DRAM_DATA2_B
DRAM_DATA3_A: U1.F2(DRAM_DQ03) ; port DRAM_A_DATA.DRAM_DATA3_A
DRAM_DATA3_B: U1.Y2(DRAM_DQ19) ; port DRAM_B_DATA.DRAM_DATA3_B
DRAM_DATA4_A: U1.E2(DRAM_DQ04) ; port DRAM_A_DATA.DRAM_DATA4_A
DRAM_DATA4_B: U1.Y1(DRAM_DQ20) ; port DRAM_B_DATA.DRAM_DATA4_B
DRAM_DATA5_A: U1.C1(DRAM_DQ05) ; port DRAM_A_DATA.DRAM_DATA5_A
DRAM_DATA5_B: U1.W1(DRAM_DQ21) ; port DRAM_B_DATA.DRAM_DATA5_B
DRAM_DATA6_A: U1.C2(DRAM_DQ06) ; port DRAM_A_DATA.DRAM_DATA6_A
DRAM_DATA6_B: U1.AC2(DRAM_DQ22) ; port DRAM_B_DATA.DRAM_DATA6_B
DRAM_DATA7_A: U1.B1(DRAM_DQ07) ; port DRAM_A_DATA.DRAM_DATA7_A
DRAM_DATA7_B: U1.AD1(DRAM_DQ23) ; port DRAM_B_DATA.DRAM_DATA7_B
DRAM_DATA8_A: U1.G1(DRAM_DQ08) ; port DRAM_A_DATA.DRAM_DATA8_A
DRAM_DATA8_B: U1.AH3(DRAM_DQ24) ; port DRAM_B_DATA.DRAM_DATA8_B
DRAM_DATA9_A: U1.H1(DRAM_DQ09) ; port DRAM_A_DATA.DRAM_DATA9_A
DRAM_DATA9_B: U1.AJ2(DRAM_DQ25) ; port DRAM_B_DATA.DRAM_DATA9_B
DRAM_DATA10_A: U1.K1(DRAM_DQ10) ; port DRAM_A_DATA.DRAM_DATA10_A
DRAM_DATA10_B: U1.AE1(DRAM_DQ26) ; port DRAM_B_DATA.DRAM_DATA10_B
DRAM_DATA11_A: U1.K2(DRAM_DQ11) ; port DRAM_A_DATA.DRAM_DATA11_A
DRAM_DATA11_B: U1.AD2(DRAM_DQ27) ; port DRAM_B_DATA.DRAM_DATA11_B
DRAM_DATA12_A: U1.L2(DRAM_DQ12) ; port DRAM_A_DATA.DRAM_DATA12_A
DRAM_DATA12_B: U1.AE2(DRAM_DQ28) ; port DRAM_B_DATA.DRAM_DATA12_B
DRAM_DATA13_A: U1.L1(DRAM_DQ13) ; port DRAM_A_DATA.DRAM_DATA13_A
DRAM_DATA13_B: U1.AG1(DRAM_DQ29) ; port DRAM_B_DATA.DRAM_DATA13_B
DRAM_DATA14_A: U1.G2(DRAM_DQ14) ; port DRAM_A_DATA.DRAM_DATA14_A
DRAM_DATA14_B: U1.AG2(DRAM_DQ30) ; port DRAM_B_DATA.DRAM_DATA14_B
DRAM_DATA15_A: U1.F1(DRAM_DQ15) ; port DRAM_A_DATA.DRAM_DATA15_A
DRAM_DATA15_B: U1.AH1(DRAM_DQ31) ; port DRAM_B_DATA.DRAM_DATA15_B
DRAM_DMI0_A: U1.B2(DRAM_DM0) ; port CHA_DATA_CTRL.DRAM_DMI0_A
DRAM_DMI0_B: U1.AB2(DRAM_DM2) ; port CHB_DATA_CTRL.DRAM_DMI0_B
DRAM_DMI1_A: U1.H2(DRAM_DM1) ; port CHA_DATA_CTRL.DRAM_DMI1_A
DRAM_DMI1_B: U1.AH2(DRAM_DM3) ; port CHB_DATA_CTRL.DRAM_DMI1_B
DRAM_nCS0_A: U1.N6(DRAM_AC02/CS0_A_/_CS0_n) ; port CHA_DATA_CTRL.DRAM_nCS0_A
DRAM_nCS0_B: U1.U4(DRAM_AC23/CS0_B_/_--) ; port CHB_DATA_CTRL.DRAM_nCS0_B
DRAM_nCS1_A: U1.J4(DRAM_AC03/CS1_A_/_C0) ; port CHA_DATA_CTRL.DRAM_nCS1_A
DRAM_nCS1_B: U1.AA6(DRAM_AC22/CS1_B_/_--) ; port CHB_DATA_CTRL.DRAM_nCS1_B
DRAM_nRESET: R1.2 U1.T1(DRAM_RESET_N) ; port DRAM_nRESET
DRAM_SDQS0_A_N: U1.D1(DRAM_DQS0_N) ; port CHA_DATA_CTRL.DRAM_SDQS0_A_N
DRAM_SDQS0_A_P: U1.D2(DRAM_DQS0_P) ; port CHA_DATA_CTRL.DRAM_SDQS0_A_P
DRAM_SDQS0_B_N: U1.AA1(DRAM_DQS2_N) ; port CHB_DATA_CTRL.DRAM_SDQS0_B_N
DRAM_SDQS0_B_P: U1.AA2(DRAM_DQS2_P) ; port CHB_DATA_CTRL.DRAM_SDQS0_B_P
DRAM_SDQS1_A_N: U1.J1(DRAM_DQS1_N) ; port CHA_DATA_CTRL.DRAM_SDQS1_A_N
DRAM_SDQS1_A_P: U1.J2(DRAM_DQS1_P) ; port CHA_DATA_CTRL.DRAM_SDQS1_A_P
DRAM_SDQS1_B_N: U1.AF1(DRAM_DQS3_N) ; port CHB_DATA_CTRL.DRAM_SDQS1_B_N
DRAM_SDQS1_B_P: U1.AF2(DRAM_DQS3_P) ; port CHB_DATA_CTRL.DRAM_SDQS1_B_P
DRAM_VREF: TP3.1 U1.R2(DRAM_VREF)
NetR2_2: R2.2 U1.R1(DRAM_ZN)
NetTP4_1: TP4.1 U1.P2(DRAM_AC19/MTEST_/_MTEST)

Not connected (* = marked no-connect by the designer): U1 AC4(DRAM_AC37/--_/_ODT1)* AC5(DRAM_AC38/--_/_CS1_n)* G4(DRAM_AC06/--_/_ACT_n)* J5(DRAM_AC07/--_/_A9)* L5(DRAM_AC14/_--_/_A4)* N1(DRAM_AC16/--_/_CK_t_A)* N2(DRAM_AC17/--_/_CK_c_A)* P1(DRAM_AC26/--_/_BA1)* R4(DRAM_AC27/--_/_PARITY)* R5(DRAM_AC15/--_/_A3)* T2(DRAM_ALERT_N)* U1(DRAM_AC34/_--_/_WE_n(A14))* U2(DRAM_AC35/--_/_RAS_n(A16))* W6(DRAM_AC36/--_/_ODT0)*

### Layout directives
differential pair; differential pair class Z85: DRAM_CK_A_N, DRAM_CK_A_P, DRAM_CK_B_N, DRAM_CK_B_P, DRAM_SDQS0_A_N, DRAM_SDQS0_A_P, DRAM_SDQS0_B_N, DRAM_SDQS0_B_P, DRAM_SDQS1_A_N, DRAM_SDQS1_A_P, DRAM_SDQS1_B_N, DRAM_SDQS1_B_P
net class Z50: DRAM_CA0_A, DRAM_CA0_B, DRAM_CA1_A, DRAM_CA1_B, DRAM_CA2_A, DRAM_CA2_B, DRAM_CA3_A, DRAM_CA3_B, DRAM_CA4_A, DRAM_CA4_B, DRAM_CA5_A, DRAM_CA5_B, DRAM_CKE0_A, DRAM_CKE0_B, DRAM_CKE1_A, DRAM_CKE1_B, DRAM_DATA0_A, DRAM_DATA0_B, DRAM_DATA1_A, DRAM_DATA1_B, DRAM_DATA2_A, DRAM_DATA2_B, DRAM_DATA3_A, DRAM_DATA3_B, DRAM_DATA4_A, DRAM_DATA4_B, DRAM_DATA5_A, DRAM_DATA5_B, DRAM_DATA6_A, DRAM_DATA6_B, DRAM_DATA7_A, DRAM_DATA7_B, DRAM_DATA8_A, DRAM_DATA8_B, DRAM_DATA9_A, DRAM_DATA9_B, DRAM_DATA10_A, DRAM_DATA10_B, DRAM_DATA11_A, DRAM_DATA11_B, DRAM_DATA12_A, DRAM_DATA12_B, DRAM_DATA13_A, DRAM_DATA13_B, DRAM_DATA14_A, DRAM_DATA14_B, DRAM_DATA15_A, DRAM_DATA15_B, DRAM_DMI0_A, DRAM_DMI0_B, DRAM_DMI1_A, DRAM_DMI1_B, DRAM_nCS0_A, DRAM_nCS0_B, DRAM_nCS1_A, DRAM_nCS1_B

### Notes on the sheet
- CPU DDR
- Note:
- Differential Pairs Z85
- PCB Des :
- Approv By :
- Project Title :
- Sheet Title :
- Date :
- PCB Version :
- Size :
- A3
- Page :
- PCB Revision :
- (in symbol IC_MPU_8M_PLUS_MIMX8ML8DVNLZAB, part A) i.MX8MP - DDR; (LPDDR4/DDR4)

### Library data of the parts
R1 = RES_10K_1/12W_1%_0201: SMD Chip Resistor, 10 kOhm, ± 1%, 50 mW, 0201 [0603 Metric], Thick Film, General Purpose; Manufacturer: Yageo; Temperature Coefficient: 200ppm/°C; Power Rating: 50mW; Voltage Rating: 25V; Supplier 1: Digikey; Manufacturer Part Number: RC0201FR-0710KL; RoHS: Yes; Category: Chip SMD Resistors; Stock 1: 12030325; Pricing 1: 1=0.1, 10=0.027, 50=0.0172, 100=0.0143, 500=0.00988, 1000=0.00854, 5000=0.00629 (USD); Case/Package: 0201; Number of Pins: 2NUMBER; Contact Plating: Tin,Matte; Case Code (Metric): 0603; Weight: 6E-06oz; Min Operating Temperature: -55°C; Max Operating Temperature: 125°C; Packaging: Tape and Reel; Package Quantity: 10000; Termination: SMD/SMT; Resistor Type: Thick Film; Series: RC; Number of Terminations: 2; Max Power Dissipation: 50mW; Working Voltage: 25V; Features: Moisture Resistant; Technology: THICK FILM; Resistance Tolerance: 1%; Construction: Rectangular; Voltage Rating (DC): 25V; Length: 0.6mm; Width: 0.012inch; Height: 0.01inch; Depth: 0.3mm; RoHS Compliant: Yes; Reach SVHC Compliant: No; Military Standard: Not; Lead Free: 5697LeadFree; ComponentLink1URL: https://datasheet.ciiva.com/7660/1421516-7660807.pdf?src-supplier=Element14; ComponentLink1Description: https://datasheet.ciiva.com/7660/1421516-7660807.pdf?src-supplier=Element14; ComponentLink2URL: https://datasheet.ciiva.com/46391/1421516-46391339.pdf?src-supplier=Element14; ComponentLink2Description: https://datasheet.ciiva.com/46391/1421516-46391339.pdf?src-supplier=Element14; ComponentLink3URL: https://datasheet.ciiva.com/2467/pyu-r-int-thick-7-2467110.pdf?src-supplier=Digikey; ComponentLink3Description: https://datasheet.ciiva.com/2467/pyu-r-int-thick-7-2467110.pdf?src-supplier=Digikey; ComponentLink4URL: https://datasheet.ciiva.com/2467/pyu-r-int-thick-7-2467111.pdf?src-supplier=Digikey; ComponentLink4Description: https://datasheet.ciiva.com/2467/pyu-r-int-thick-7-2467111.pdf?src-supplier=Digikey; ComponentLink5URL: https://datasheet.ciiva.com/2467/pyu-r-int-thick-7-2467109.pdf?src-supplier=Digikey; ComponentLink5Description: https://datasheet.ciiva.com/2467/pyu-r-int-thick-7-2467109.pdf?src-supplier=Digikey; ComponentLink6URL: https://datasheet.ciiva.com/26829/getdatasheetpartid-421074-26829851.pdf?src-supplier=Verical; ComponentLink6Description: https://datasheet.ciiva.com/26829/getdatasheetpartid-421074-26829851.pdf?src-supplier=Verical; ComponentLink7URL: https://datasheet.ciiva.com/8891/pyu-rc0201-51-rohs-l-8-8891384.pdf?src-supplier=Avnet; ComponentLink7Description: https://datasheet.ciiva.com/8891/pyu-rc0201-51-rohs-l-8-8891384.pdf?src-supplier=Avnet; Supplier Part Number 1: 311-10.0KMCT-ND
R2 = RES_240R_1%_50mW_0201: SMD Chip Resistor, 240 Ohm, ± 1%, 50 mW, 0201 [0603 Metric], Thick Film, General Purpose; Manufacturer: Yageo; Power Rating: 50mW; Temperature Coefficient: 200ppm/°C; Supplier 1: Digikey; Manufacturer Part Number: RC0201FR-07240RL; RoHS: Yes; Category: Chip SMD Resistors; Stock 1: 736295; Pricing 1: 1=0.1, 10=0.027, 50=0.0172, 100=0.0143, 500=0.00988, 1000=0.00854, 5000=0.00629 (USD); Mount: Surface Mount; Case Code (Metric): 0603; Case Code (Imperial): 0201; Size Code: 0201; Min Operating Temperature: -55°C; Max Operating Temperature: 125°C; Packaging: Cut Tape; Number of Terminations: 2; Max Power Dissipation: 50mW; Features: Moisture Resistant; Series: RC; Lead Free: Lead Free; RoHS Compliant: Yes; ComponentLink1URL: https://datasheet.octopart.com/RC0201FR-07240RL-Yageo-datasheet-164759695.pdf?src-supplier=Future+Electronics; ComponentLink1Description: https://datasheet.octopart.com/RC0201FR-07240RL-Yageo-datasheet-164759695.pdf?src-supplier=Future+Electronics; ComponentLink2URL: http://www.yageo.com/documents/recent/PYu-RC0201_51_RoHS_L_(8).pdf?src-supplier=Future+Electronics; ComponentLink2Description: http://www.yageo.com/documents/recent/PYu-RC0201_51_RoHS_L_(8).pdf?src-supplier=Future+Electronics; ComponentLink3URL: https://datasheet.octopart.com/RC0201FR-07240RL-Yageo-datasheet-148775077.pdf?src-supplier=TME; ComponentLink3Description: https://datasheet.octopart.com/RC0201FR-07240RL-Yageo-datasheet-148775077.pdf?src-supplier=TME; Supplier Part Number 1: YAG2528DKR-ND
TP3 TP4 = TP_PAD_SMD_SMALL: as TP21 on sheet CPU IO
U1 = IC_MPU_8M_PLUS_MIMX8ML8DVNLZAB: as U1 on sheet CPU IO; Supplier 1: Arrow Electronics; Manufacturer Part Number: MIMX8ML8DVNLZAB; RoHS: Yes; Category: Microprocessors; Stock 1: 1036; Pricing 1: 1=54.8, 5=52.24, 10=44.19, 25=42.8, 50=39.95, 100=31.83 (USD); Supplier Part Number 1: MIMX8ML8DVNLZAB

## Sheet CPU PHY.SchDoc: CPU PHY
size A2; DrawnBy: UKAYACIK; Engineer: UKAYACIK; DocumentNumber: 5; Revision: B; SheetNumber: 6; SheetTotal: 21
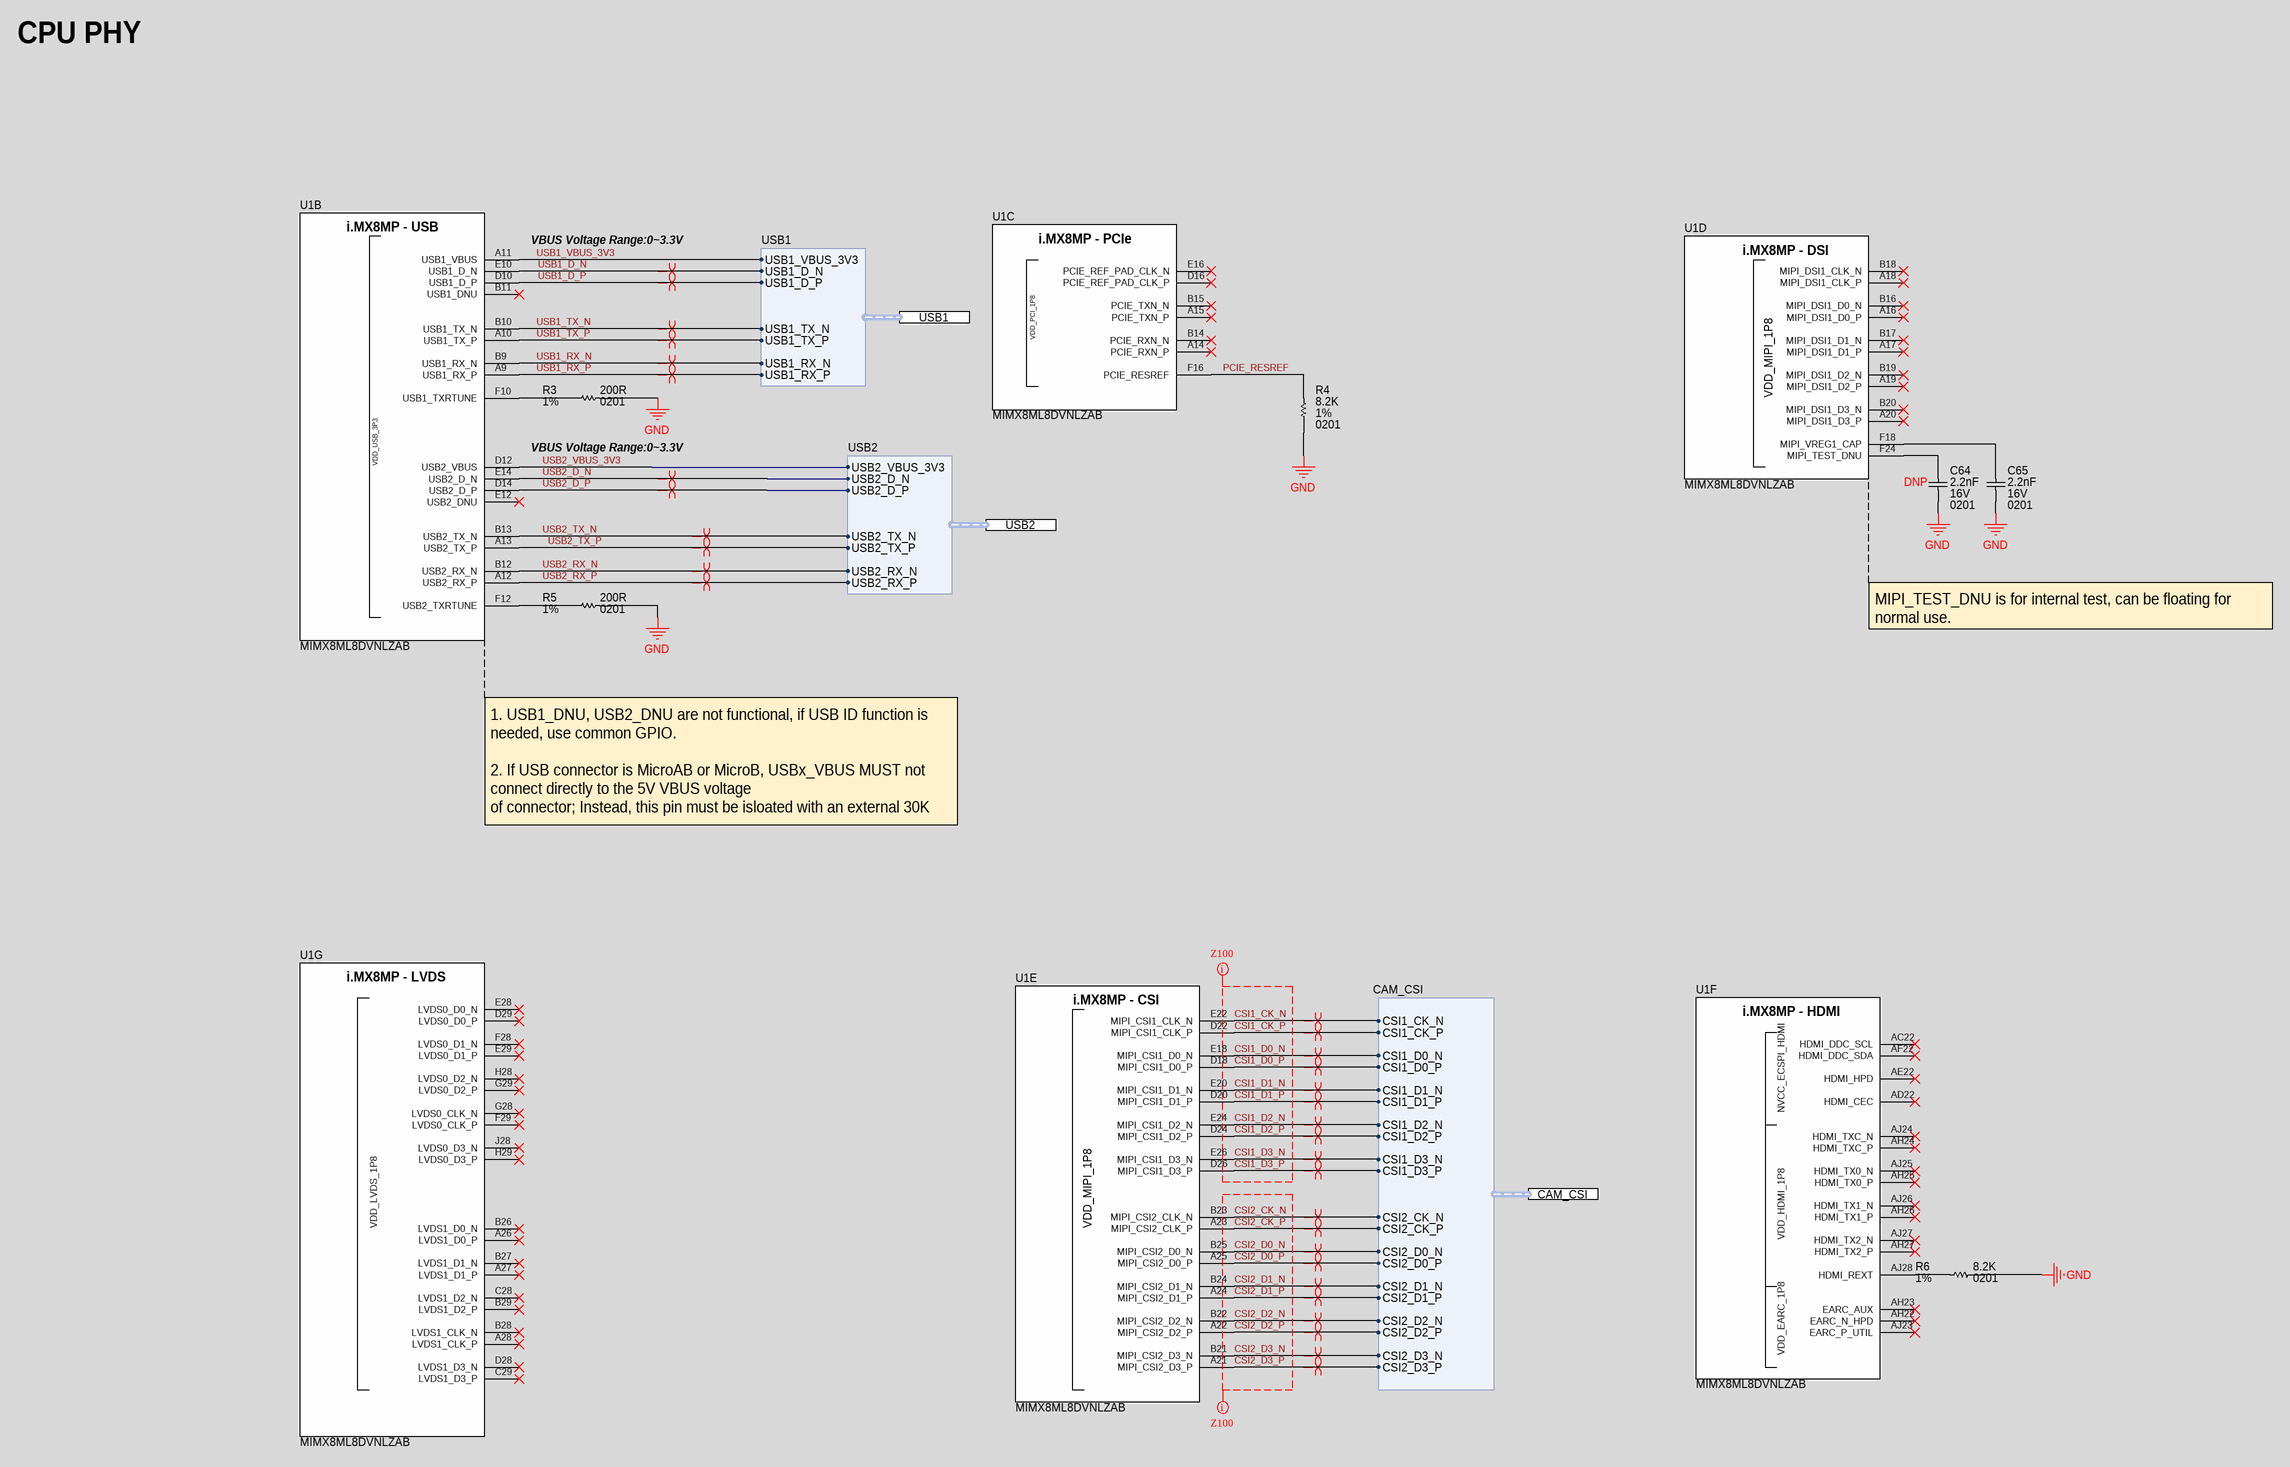
[diagram p5: CPU PHY.SchDoc]

### Parts
C64  Voltage Rating: 16V  Capacitance: 2.2nF  Case/Package: 0201  [CAP_0201_CAPC0603X03N]  (hidden comment: GRM033R71C222KA88D)
C65  Voltage Rating: 16V  Capacitance: 2.2nF  Case/Package: 0201  [CAP_0201_CAPC0603X03N]  (hidden comment: GRM033R71C222KA88D)
R3  Tolerance: 1%  Resistance: 200R  Case/Package: 0201  [RES_0201_RESC0603X02N]  (hidden comment: RC0201FR-07200RL)
R4  Tolerance: 1%  Resistance: 8.2K  Case/Package: 0201  [RES_0201_RESC0603X02N]  (hidden comment: RC0201FR-078K2L)
R5  Tolerance: 1%  Resistance: 200R  Case/Package: 0201  [RES_0201_RESC0603X02N]  (hidden comment: RC0201FR-07200RL)
R6  Tolerance: 1%  Resistance: 8.2K  Case/Package: 0201  [RES_0201_RESC0603X02N]  (hidden comment: RC0201FR-078K2L)
U1  MIMX8ML8DVNLZAB  [IC_MPU_BGA548C50P29X29_1500X1500X148]  (parts B,C,D,E,F,G of 15)

### Ports
CAM_CSI (harness CAM_CSI), USB1 (harness USB1), USB2 (harness USB2)

### Harnesses
USB1: USB1_VBUS_3V3, USB1_D_N, USB1_D_P, USB1_TX_N, USB1_TX_P, USB1_RX_N, USB1_RX_P
CAM_CSI: CSI1_CK_N, CSI1_CK_P, CSI1_D0_N, CSI1_D0_P, CSI1_D1_N, CSI1_D1_P, CSI1_D2_N, CSI1_D2_P, CSI1_D3_N, CSI1_D3_P, CSI2_CK_N, CSI2_CK_P, CSI2_D0_N, CSI2_D0_P, CSI2_D1_N, CSI2_D1_P, CSI2_D2_N, CSI2_D2_P, CSI2_D3_N, CSI2_D3_P
USB2: USB2_VBUS_3V3, USB2_TX_N, USB2_TX_P, USB2_RX_N, USB2_RX_P, USB2_D_N, USB2_D_P

### Nets
GND: C64.1 C65.1 R3.2 R4.1 R5.2 R6.1
CSI1_CK_N: U1.E22(MIPI_CSI1_CLK_N) ; port CAM_CSI.CSI1_CK_N
CSI1_CK_P: U1.D22(MIPI_CSI1_CLK_P) ; port CAM_CSI.CSI1_CK_P
CSI1_D0_N: U1.E18(MIPI_CSI1_D0_N) ; port CAM_CSI.CSI1_D0_N
CSI1_D0_P: U1.D18(MIPI_CSI1_D0_P) ; port CAM_CSI.CSI1_D0_P
CSI1_D1_N: U1.E20(MIPI_CSI1_D1_N) ; port CAM_CSI.CSI1_D1_N
CSI1_D1_P: U1.D20(MIPI_CSI1_D1_P) ; port CAM_CSI.CSI1_D1_P
CSI1_D2_N: U1.E24(MIPI_CSI1_D2_N) ; port CAM_CSI.CSI1_D2_N
CSI1_D2_P: U1.D24(MIPI_CSI1_D2_P) ; port CAM_CSI.CSI1_D2_P
CSI1_D3_N: U1.E26(MIPI_CSI1_D3_N) ; port CAM_CSI.CSI1_D3_N
CSI1_D3_P: U1.D26(MIPI_CSI1_D3_P) ; port CAM_CSI.CSI1_D3_P
CSI2_CK_N: U1.B23(MIPI_CSI2_CLK_N) ; port CAM_CSI.CSI2_CK_N
CSI2_CK_P: U1.A23(MIPI_CSI2_CLK_P) ; port CAM_CSI.CSI2_CK_P
CSI2_D0_N: U1.B25(MIPI_CSI2_D0_N) ; port CAM_CSI.CSI2_D0_N
CSI2_D0_P: U1.A25(MIPI_CSI2_D0_P) ; port CAM_CSI.CSI2_D0_P
CSI2_D1_N: U1.B24(MIPI_CSI2_D1_N) ; port CAM_CSI.CSI2_D1_N
CSI2_D1_P: U1.A24(MIPI_CSI2_D1_P) ; port CAM_CSI.CSI2_D1_P
CSI2_D2_N: U1.B22(MIPI_CSI2_D2_N) ; port CAM_CSI.CSI2_D2_N
CSI2_D2_P: U1.A22(MIPI_CSI2_D2_P) ; port CAM_CSI.CSI2_D2_P
CSI2_D3_N: U1.B21(MIPI_CSI2_D3_N) ; port CAM_CSI.CSI2_D3_N
CSI2_D3_P: U1.A21(MIPI_CSI2_D3_P) ; port CAM_CSI.CSI2_D3_P
PCIE_RESREF: R4.2 U1.F16(PCIE_RESREF)
USB1_D_N: U1.E10(USB1_D_N) ; port USB1.USB1_D_N
USB1_D_P: U1.D10(USB1_D_P) ; port USB1.USB1_D_P
USB1_RX_N: U1.B9(USB1_RX_N) ; port USB1.USB1_RX_N
USB1_RX_P: U1.A9(USB1_RX_P) ; port USB1.USB1_RX_P
USB1_TX_N: U1.B10(USB1_TX_N) ; port USB1.USB1_TX_N
USB1_TX_P: U1.A10(USB1_TX_P) ; port USB1.USB1_TX_P
USB1_VBUS_3V3: U1.A11(USB1_VBUS) ; port USB1.USB1_VBUS_3V3
USB2_D_N: U1.E14(USB2_D_N) ; port USB2.USB2_D_N
USB2_D_P: U1.D14(USB2_D_P) ; port USB2.USB2_D_P
USB2_RX_N: U1.B12(USB2_RX_N) ; port USB2.USB2_RX_N
USB2_RX_P: U1.A12(USB2_RX_P) ; port USB2.USB2_RX_P
USB2_TX_N: U1.B13(USB2_TX_N) ; port USB2.USB2_TX_N
USB2_TX_P: U1.A13(USB2_TX_P) ; port USB2.USB2_TX_P
USB2_VBUS_3V3: U1.D12(USB2_VBUS) ; port USB2.USB2_VBUS_3V3
NetC64_2: C64.2 U1.F24(MIPI_TEST_DNU)
NetC65_2: C65.2 U1.F18(MIPI_VREG1_CAP)
NetR3_1: R3.1 U1.F10(USB1_TXRTUNE)
NetR5_1: R5.1 U1.F12(USB2_TXRTUNE)
NetR6_2: R6.2 U1.AJ28(HDMI_REXT)

Not connected (* = marked no-connect by the designer): U1 A14(PCIE_RXN_P)* A15(PCIE_TXN_P)* A16(MIPI_DSI1_D0_P)* A17(MIPI_DSI1_D1_P)* A18(MIPI_DSI1_CLK_P)* A19(MIPI_DSI1_D2_P)* A20(MIPI_DSI1_D3_P)* A26(LVDS1_D0_P)* A27(LVDS1_D1_P)* A28(LVDS1_CLK_P)* AC22(HDMI_DDC_SCL)* AD22(HDMI_CEC)* AE22(HDMI_HPD)* AF22(HDMI_DDC_SDA)* AH22(EARC_N_HPD)* AH23(EARC_AUX)* AH24(HDMI_TXC_P)* AH25(HDMI_TX0_P)* AH26(HDMI_TX1_P)* AH27(HDMI_TX2_P)* AJ23(EARC_P_UTIL)* AJ24(HDMI_TXC_N)* AJ25(HDMI_TX0_N)* AJ26(HDMI_TX1_N)* AJ27(HDMI_TX2_N)* B11(USB1_DNU)* B14(PCIE_RXN_N)* B15(PCIE_TXN_N)* B16(MIPI_DSI1_D0_N)* B17(MIPI_DSI1_D1_N)* B18(MIPI_DSI1_CLK_N)* B19(MIPI_DSI1_D2_N)* B20(MIPI_DSI1_D3_N)* B26(LVDS1_D0_N)* B27(LVDS1_D1_N)* B28(LVDS1_CLK_N)* B29(LVDS1_D2_P)* C28(LVDS1_D2_N)* C29(LVDS1_D3_P)* D16(PCIE_REF_PAD_CLK_P)* D28(LVDS1_D3_N)* D29(LVDS0_D0_P)* E12(USB2_DNU)* E16(PCIE_REF_PAD_CLK_N)* E28(LVDS0_D0_N)* E29(LVDS0_D1_P)* F28(LVDS0_D1_N)* F29(LVDS0_CLK_P)* G28(LVDS0_CLK_N)* G29(LVDS0_D2_P)* H28(LVDS0_D2_N)* H29(LVDS0_D3_P)* J28(LVDS0_D3_N)*

### Layout directives
net class CSI1_Z100: CSI1_CK_N, CSI1_CK_P, CSI1_D0_N, CSI1_D0_P, CSI1_D1_N, CSI1_D1_P, CSI1_D2_N, CSI1_D2_P, CSI1_D3_N, CSI1_D3_P
net class CSI2_Z100: CSI2_CK_N, CSI2_CK_P, CSI2_D0_N, CSI2_D0_P, CSI2_D1_N, CSI2_D1_P, CSI2_D2_N, CSI2_D2_P, CSI2_D3_N, CSI2_D3_P
differential pair; differential pair class Z100: CSI1_CK_N, CSI1_CK_P, CSI1_D0_N, CSI1_D0_P, CSI1_D1_N, CSI1_D1_P, CSI1_D2_N, CSI1_D2_P, CSI1_D3_N, CSI1_D3_P, CSI2_CK_N, CSI2_CK_P, CSI2_D0_N, CSI2_D0_P, CSI2_D1_N, CSI2_D1_P, CSI2_D2_N, CSI2_D2_P, CSI2_D3_N, CSI2_D3_P
differential pair; differential pair class Z90: USB1_D_N, USB1_D_P, USB1_RX_N, USB1_RX_P, USB1_TX_N, USB1_TX_P, USB2_D_N, USB2_D_P, USB2_RX_N, USB2_RX_P, USB2_TX_N, USB2_TX_P

### Notes on the sheet
- CPU PHY
- VBUS Voltage Range:0~3.3V
- (near C64) DNP
- MIPI_TEST_DNU is for internal test, can be floating for normal use.
- 1. USB1_DNU, USB2_DNU are not functional, if USB ID function is needed, use common GPIO.
  2. If USB connector is MicroAB or MicroB, USBx_VBUS MUST not connect directly to the 5V VBUS voltage
  of connector; Instead, this pin must be isloated with an external 30K 1% resistor.
- PCB Des :
- Approv By :
- Project Title :
- Sheet Title :
- Date :
- Page :
- PCB Version :
- PCB Revision :
- Size :
- A2
- (in symbol IC_MPU_8M_PLUS_MIMX8ML8DVNLZAB, part B) i.MX8MP - USB
- (in symbol IC_MPU_8M_PLUS_MIMX8ML8DVNLZAB, part C) i.MX8MP - PCIe
- (in symbol IC_MPU_8M_PLUS_MIMX8ML8DVNLZAB, part D) i.MX8MP - DSI
- (in symbol IC_MPU_8M_PLUS_MIMX8ML8DVNLZAB, part E) i.MX8MP - CSI
- (in symbol IC_MPU_8M_PLUS_MIMX8ML8DVNLZAB, part F) i.MX8MP - HDMI
- (in symbol IC_MPU_8M_PLUS_MIMX8ML8DVNLZAB, part G) i.MX8MP - LVDS

### Library data of the parts
C64 C65 = CAP_2200pF_16V_X7R_0201: Multilayer Ceramic Capacitor, 2200 pF, 16 V, ± 10%, X7R, 0201 [0603 Metric]; Manufacturer: Murata; Supplier 1: Digikey; Manufacturer Part Number: GRM033R71C222KA88D; RoHS: Yes; Category: Ceramic Capacitors; Stock 1: 653022; Pricing 1: 1=0.1, 10=0.01, 50=0.0056, 100=0.0043, 500=0.00324, 1000=0.00255, 2500=0.00232, 5000=0.00213 (USD); Mount: Surface Mount; Case Code (Metric): 0603; Case Code (Imperial): 0201; Material: Ceramic; Min Operating Temperature: -55°C; Max Operating Temperature: 125°C; Package Quantity: 1; Tolerance: 10%; Packaging: Tape and Reel; Voltage Rating (DC): 16V; Dielectric: X7R; Termination: SMD/SMT; Voltage: 16V; Series: GRM; Construction: Flat; Length: 0.6mm; Width: 0.012inch; Height: 0.3mm; Thickness: 0.013inch; Depth: 0.3mm; Radiation Hardening: No; Reach SVHC Compliant: No; Lead Free: Lead Free; RoHS Compliant: Yes; ComponentLink1URL: https://datasheet.ciiva.com/130/grm033r71c222ka88-01-130159.pdf?src-supplier=Digikey; ComponentLink1Description: https://datasheet.ciiva.com/130/grm033r71c222ka88-01-130159.pdf?src-supplier=Digikey; ComponentLink2URL: https://datasheet.ciiva.com/130/grm033r71c222ka88-01-130158.pdf?src-supplier=Digikey; ComponentLink2Description: https://datasheet.ciiva.com/130/grm033r71c222ka88-01-130158.pdf?src-supplier=Digikey; ComponentLink3URL: https://datasheet.ciiva.com/130/product-130160.pdf?src-supplier=Digikey; ComponentLink3Description: https://datasheet.ciiva.com/130/product-130160.pdf?src-supplier=Digikey; ComponentLink4URL: https://datasheet.ciiva.com/18184/getdatasheetpartid-153132-18184090.pdf?src-supplier=Verical; ComponentLink4Description: https://datasheet.ciiva.com/18184/getdatasheetpartid-153132-18184090.pdf?src-supplier=Verical; ComponentLink5URL: https://datasheet.ciiva.com/29199/455766-da-01-en-vs-kondensator-0201-29199161.pdf?src-supplier=Conrad; ComponentLink5Description: https://datasheet.ciiva.com/29199/455766-da-01-en-vs-kondensator-0201-29199161.pdf?src-supplier=Conrad; ComponentLink6URL: https://datasheet.ciiva.com/11620/product-11620555.pdf?src-supplier=Avnet; ComponentLink6Description: https://datasheet.ciiva.com/11620/product-11620555.pdf?src-supplier=Avnet; Supplier Part Number 1: 490-3190-1-ND
R3 R5 = RES_200R_1%_50mW_0201: SMD Chip Resistor, 200 Ohm, ± 1%, 50 mW, 0201 [0603 Metric], Thick Film, General Purpose; Manufacturer: Yageo; Voltage Rating: 25V; Power Rating: 50mW; Temperature Coefficient: 200ppm/°C; Supplier 1: Mouser; Manufacturer Part Number: RC0201FR-07200RL; RoHS: Yes; Category: Chip SMD Resistors; Stock 1: 289096; Pricing 1: 1=0.1, 10=0.015, 50=0.015, 100=0.008, 1000=0.006, 10000=0.006 (USD); Case Code (Imperial): 0201; Case Code (Metric): 0603; Size Code: 0201; Min Operating Temperature: -55°C; Max Operating Temperature: 125°C; Package Quantity: 10000; Packaging: Tape and Reel; Termination: SMD/SMT; Number of Terminations: 2; Max Power Dissipation: 50mW; Features: Moisture Resistant; Series: RC; Length: 0.6mm; Width: 0.3mm; Height: 0.23mm; Lead Free: Lead Free; RoHS Compliant: Yes; ComponentLink1URL: http://www.mouser.com/ds/2/447/RC0201-559633.pdf?src-supplier=Mouser; ComponentLink1Description: http://www.mouser.com/ds/2/447/RC0201-559633.pdf?src-supplier=Mouser; ComponentLink2URL: https://datasheet.octopart.com/RC0201FR-07200RL-Yageo-datasheet-164759695.pdf?src-supplier=Future+Electronics; ComponentLink2Description: https://datasheet.octopart.com/RC0201FR-07200RL-Yageo-datasheet-164759695.pdf?src-supplier=Future+Electronics; ComponentLink3URL: http://www.yageo.com/documents/recent/PYu-RC0201_51_RoHS_L_(8).pdf?src-supplier=Future+Electronics; ComponentLink3Description: http://www.yageo.com/documents/recent/PYu-RC0201_51_RoHS_L_(8).pdf?src-supplier=Future+Electronics; ComponentLink4URL: http://www.yageo.com/documents/recent/PYu-RC_Group_51_RoHS_L_10.pdf?src-supplier=Digikey; ComponentLink4Description: http://www.yageo.com/documents/recent/PYu-RC_Group_51_RoHS_L_10.pdf?src-supplier=Digikey; ComponentLink5URL: http://www.yageo.com/documents/recent/PYu-RC_Group_51_RoHS_L_9.pdf?src-supplier=Digikey; ComponentLink5Description: http://www.yageo.com/documents/recent/PYu-RC_Group_51_RoHS_L_9.pdf?src-supplier=Digikey; Supplier Part Number 1: 603-RC0201FR-07200RL
R4 R6 = RES_8.2K_1%_50mW_0201: Res Thick Film 0201 8.2K Ohm 1% 1/20W ±200ppm/°C Molded SMD Paper T/R; Manufacturer: Yageo; Power Rating: 50mW; Voltage Rating: 25V; Supplier 1: Digikey; Manufacturer Part Number: RC0201FR-078K2L; RoHS: Yes; Category: Chip SMD Resistors; Stock 1: 120132; Pricing 1: 1=0.1, 10=0.027, 50=0.0172, 100=0.0143, 500=0.00988, 1000=0.00854, 5000=0.00629 (USD); Case Code (Metric): 0603; Case Code (Imperial): 0201; Min Operating Temperature: -55°C; Max Operating Temperature: 125°C; Package Quantity: 10000; Packaging: Tape and Reel; Resistor Type: Thick Film; Number of Terminations: 2; Termination: SMD/SMT; Max Power Dissipation: 50mW; Temperature Coefficient: 200ppm/°C; Features: Moisture Resistant; Series: RC; Resistance Tolerance: 1%; Length: 0.024inch; Width: 0.3mm; Height: 0.01inch; Reach SVHC Compliant: No; Lead Free: Lead Free; RoHS Compliant: Yes; ComponentLink1URL: https://datasheet.ciiva.com/14985/pyu-r-int-thick-7-14985436.pdf?src-supplier=Digikey; ComponentLink1Description: https://datasheet.ciiva.com/14985/pyu-r-int-thick-7-14985436.pdf?src-supplier=Digikey; Supplier Part Number 1: YAG2353CT-ND
U1 = IC_MPU_8M_PLUS_MIMX8ML8DVNLZAB: as U1 on sheet CPU IO; Supplier 1: Arrow Electronics; Manufacturer Part Number: MIMX8ML8DVNLZAB; RoHS: Yes; Category: Microprocessors; Stock 1: 1036; Pricing 1: 1=54.8, 5=52.24, 10=44.19, 25=42.8, 50=39.95, 100=31.83 (USD); Supplier Part Number 1: MIMX8ML8DVNLZAB